# Altium project GN-1866-A-V2_HI3519V101.PRJPCB (part 2 of 4)

## Sheet P09 SYS of Hi3519.SchDoc
size 420 x 297 mm
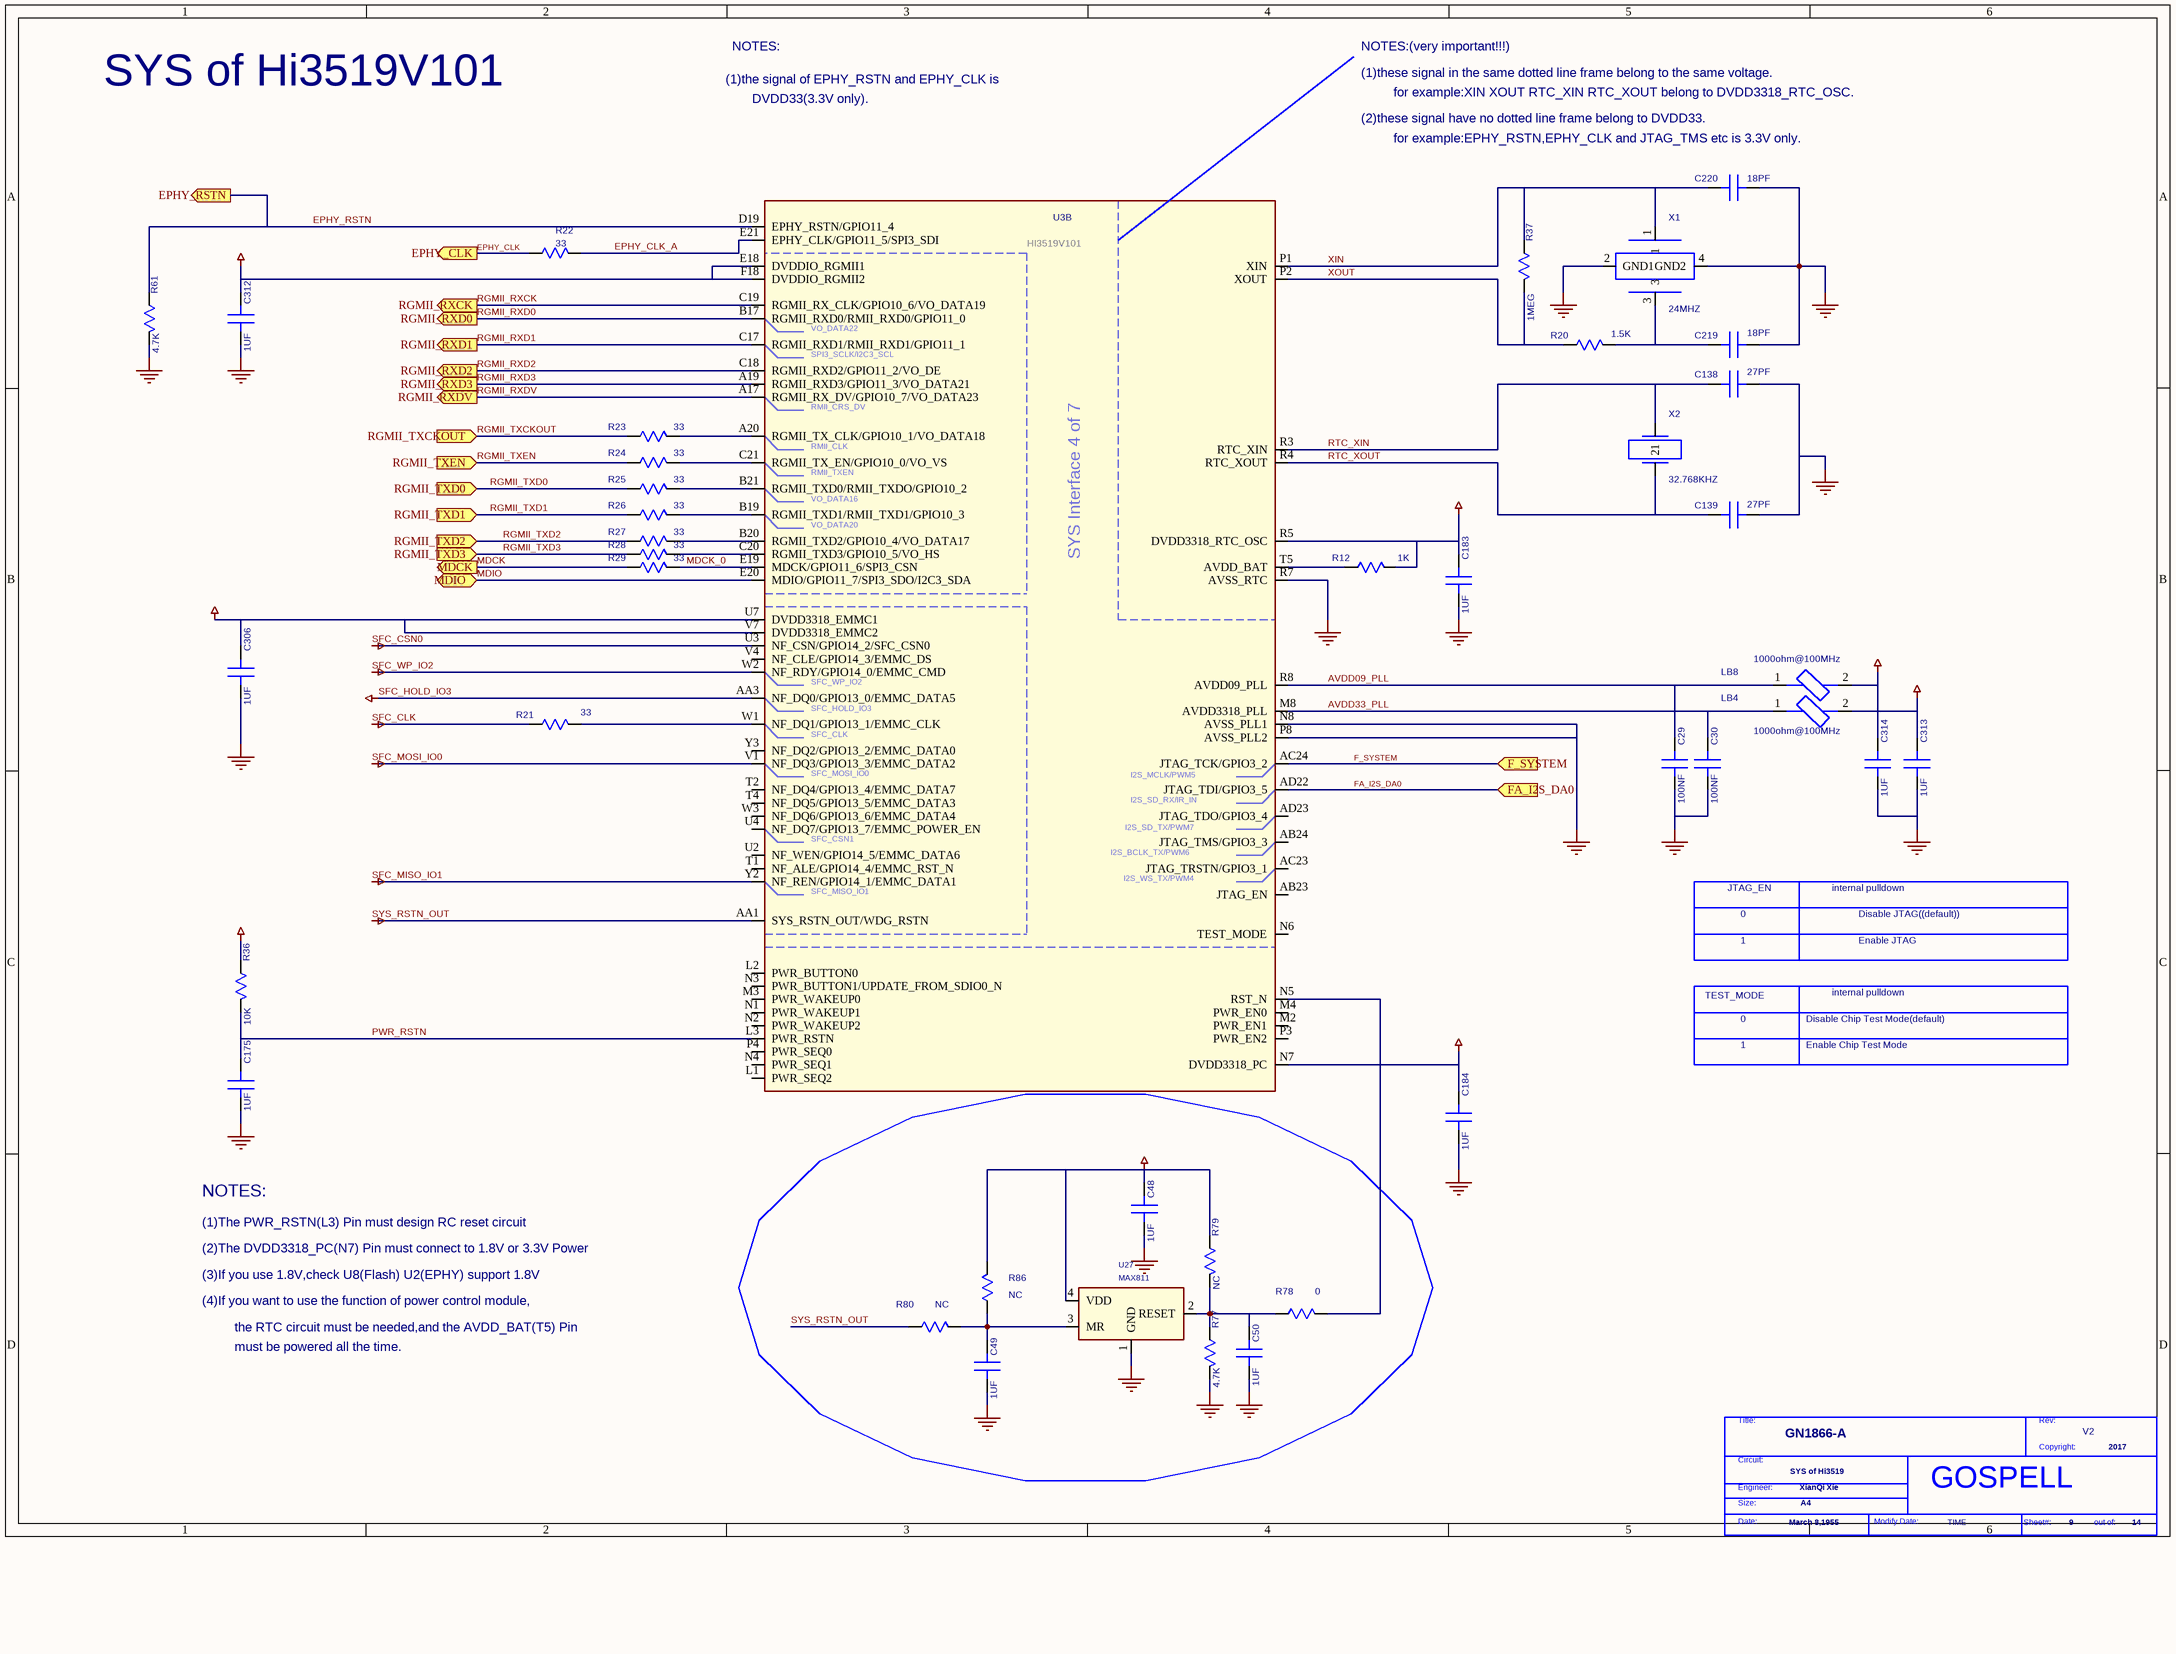
[diagram p5: P09 SYS of Hi3519.SchDoc]

### Parts
(Parts that share a designator on the sheet are numbered #1, #2 ... from top to bottom, then left to right.)
*#6  Page Modify Date: TIME  Engineer: XianQi Xie  Copyright: 2017  Title: GN1866-A  RevCode: V2  Page Size: A4  Page Create Date: March 8,1955  Page Number: 9  Page Count: 14  Doc: SYS of Hi3519  (hidden comment: GOSPELL)  (graphical)
C29  100NF  [HSC0201]
C30  100NF  [HSC0201]
C48  1UF  [SC0402]
C49  1UF  [SC0402]
C50  1UF  [SC0402]
C138  27PF  [SC0402]
C139  27PF  [SC0402]
C175  1UF  [HSC0201]
C183  1UF  [HSC0201]
C184  1UF  [HSC0201]
C219  18PF  [SC0402]
C220  18PF  [SC0402]
C306  1UF  [HSC0201]
C312  1UF  [HSC0201]
C313  1UF  [HSC0201]
C314  1UF  [HSC0201]
LB4  LB  [HSL0201-TB]  (value not drawn)
LB8  LB  [HSL0201-TB]  (value not drawn)
R12  1K  [SR0402]
R20  1.5K  [SR0402]
R21  33  [SR0402]
R22  33  [SR0402]
R23  33  [SR0402]
R24  33  [SR0402]
R25  33  [SR0402]
R26  33  [SR0402]
R27  33  [SR0402]
R28  33  [SR0402]
R29  33  [SR0402]
R36  10K  [SR0402]
R37  1MEG  [SR0402]
R61  4.7K  [SR0402]
R77  4.7K  [SR0402]
R78  0  [SR0402]
R79  NC  [SR0402]
R80  NC  [SR0402]
R86  NC  [SR0402]
U3  DEVICE: HI3519V101  [HBGA524-16-2424]  (hidden comment: HI3519V101_PER)  (part B of 7)
U27  MAX811  [SOT23-4]
X1  24MHZ  [HSX4-0302]
X2  32.768KHZ  [HSX2-0302]

### Ports
EPHY_CLK (out), EPHY_RSTN (out), F_SYSTEM (in), FA_I2S_DA0 (in), MDCK (out), MDIO (bidir), RGMII_RXCK (out), RGMII_RXD0 (out), RGMII_RXD1 (out), RGMII_RXD2 (out), RGMII_RXD3 (out), RGMII_RXDV (out), RGMII_TXCKOUT (in), RGMII_TXD0 (in), RGMII_TXD1 (in), RGMII_TXD2 (in), RGMII_TXD3 (in), RGMII_TXEN (in)

### Nets
3V3/1V8: C48.1(A) C183.1(A) C184.1(A) C306.1(A) C312.1(A) C313.1(A) LB4.2 R12.2(B) R36.1(A) R79.1(A) R86.2(B) U3.E18(DVDDIO_RGMII1) U3.F18(DVDDIO_RGMII2) U3.N7(DVDD3318_PC) U3.R5(DVDD3318_RTC_OSC) U3.U7(DVDD3318_EMMC1) U3.V7(DVDD3318_EMMC2) U27.4(VDD)
GND: C29.2(B) C30.2(B) C48.2(B) C49.2(B) C50.2(B) C138.2(B) C139.2(B) C175.2(B) C183.2(B) C184.2(B) C219.2(B) C220.2(B) C306.2(B) C312.2(B) C313.2(B) C314.2(B) R61.2(B) R77.2(B) U3.N8(AVSS_PLL1) U3.P8(AVSS_PLL2) U3.R7(AVSS_RTC) U27.1(GND) X1.2(GND1) X1.4(GND2)
SFC_CLK: R21.1(A)
SFC_CSN0: U3.U3(NF_CSN/GPIO14_2/SFC_CSN0)
SFC_HOLD_IO3: U3.AA3(NF_DQ0/GPIO13_0/EMMC_DATA5)
SFC_MISO_IO1: U3.Y2(NF_REN/GPIO14_1/EMMC_DATA1)
SFC_MOSI_IO0: U3.V1(NF_DQ3/GPIO13_3/EMMC_DATA2)
SFC_WP_IO2: U3.W2(NF_RDY/GPIO14_0/EMMC_CMD)
SYS_RSTN_OUT: R80.1(A) U3.AA1(SYS_RSTN_OUT/WDG_RSTN)
VCC_VDD_DDR_CORE: C314.1(A) LB8.2
AVDD09_PLL: C29.1(A) LB8.1 U3.R8(AVDD09_PLL)
AVDD33_PLL: C30.1(A) LB4.1 U3.M8(AVDD3318_PLL)
EPHY_CLK: R22.1(A) ; port EPHY_CLK
EPHY_CLK_A: R22.2(B) U3.E21(EPHY_CLK/GPIO11_5/SPI3_SDI)
EPHY_RSTN: R61.1(A) U3.D19(EPHY_RSTN/GPIO11_4) ; port EPHY_RSTN
F_SYSTEM: U3.AC24(JTAG_TCK/GPIO3_2) ; port F_SYSTEM
FA_I2S_DA0: U3.AD22(JTAG_TDI/GPIO3_5) ; port FA_I2S_DA0
MDCK: R29.1(A) ; port MDCK
MDCK_0: R29.2(B) U3.E19(MDCK/GPIO11_6/SPI3_CSN)
MDIO: U3.E20(MDIO/GPIO11_7/SPI3_SDO/I2C3_SDA) ; port MDIO
PWR_RSTN: C175.1(A) R36.2(B) U3.L3(PWR_RSTN)
RGMII_RXCK: U3.C19(RGMII_RX_CLK/GPIO10_6/VO_DATA19) ; port RGMII_RXCK
RGMII_RXD0: U3.B17(RGMII_RXD0/RMII_RXD0/GPIO11_0) ; port RGMII_RXD0
RGMII_RXD1: U3.C17(RGMII_RXD1/RMII_RXD1/GPIO11_1) ; port RGMII_RXD1
RGMII_RXD2: U3.C18(RGMII_RXD2/GPIO11_2/VO_DE) ; port RGMII_RXD2
RGMII_RXD3: U3.A19(RGMII_RXD3/GPIO11_3/VO_DATA21) ; port RGMII_RXD3
RGMII_RXDV: U3.A17(RGMII_RX_DV/GPIO10_7/VO_DATA23) ; port RGMII_RXDV
RGMII_TXCKOUT: R23.1(A) ; port RGMII_TXCKOUT
RGMII_TXD0: R25.1(A) ; port RGMII_TXD0
RGMII_TXD1: R26.1(A) ; port RGMII_TXD1
RGMII_TXD2: R27.1(A) ; port RGMII_TXD2
RGMII_TXD3: R28.1(A) ; port RGMII_TXD3
RGMII_TXEN: R24.1(A) ; port RGMII_TXEN
RTC_XIN: C138.1(A) U3.R3(RTC_XIN) X2.1
RTC_XOUT: C139.1(A) U3.R4(RTC_XOUT) X2.2
XIN: C220.1(A) R37.1(A) U3.P1(XIN) X1.1
XOUT: R20.1(A) R37.2(B) U3.P2(XOUT)
NetC49_1: C49.1(A) R80.2(B) R86.1(A) U27.3(MR)
NetC50_1: C50.1(A) R77.1(A) R78.1(A) R79.2(B) U27.2(RESET)
NetC219_1: C219.1(A) R20.2(B) X1.3
NetR12_1: R12.1(A) U3.T5(AVDD_BAT)
NetR21_2: R21.2(B) U3.W1(NF_DQ1/GPIO13_1/EMMC_CLK)
NetR23_2: R23.2(B) U3.A20(RGMII_TX_CLK/GPIO10_1/VO_DATA18)
NetR24_2: R24.2(B) U3.C21(RGMII_TX_EN/GPIO10_0/VO_VS)
NetR25_2: R25.2(B) U3.B21(RGMII_TXD0/RMII_TXDO/GPIO10_2)
NetR26_2: R26.2(B) U3.B19(RGMII_TXD1/RMII_TXD1/GPIO10_3)
NetR27_2: R27.2(B) U3.B20(RGMII_TXD2/GPIO10_4/VO_DATA17)
NetR28_2: R28.2(B) U3.C20(RGMII_TXD3/GPIO10_5/VO_HS)
NetR78_2: R78.2(B) U3.N5(RST_N)

Not connected (* = marked no-connect by the designer): U3 AB23(JTAG_EN) AB24(JTAG_TMS/GPIO3_3) AC23(JTAG_TRSTN/GPIO3_1) AD23(JTAG_TDO/GPIO3_4) L1(PWR_SEQ2) L2(PWR_BUTTON0) M2(PWR_EN1) M3(PWR_WAKEUP0) M4(PWR_EN0) N1(PWR_WAKEUP1) N2(PWR_WAKEUP2) N3(PWR_BUTTON1/UPDATE_FROM_SDIO0_N) N4(PWR_SEQ1) N6(TEST_MODE) P3(PWR_EN2) P4(PWR_SEQ0) T1(NF_ALE/GPIO14_4/EMMC_RST_N) T2(NF_DQ4/GPIO13_4/EMMC_DATA7) T4(NF_DQ5/GPIO13_5/EMMC_DATA3) U2(NF_WEN/GPIO14_5/EMMC_DATA6) U4(NF_DQ7/GPIO13_7/EMMC_POWER_EN) V4(NF_CLE/GPIO14_3/EMMC_DS) W3(NF_DQ6/GPIO13_6/EMMC_DATA4) Y3(NF_DQ2/GPIO13_2/EMMC_DATA0)

### Notes on the sheet
- NOTES:
- NOTES:(very important!!!)
- SYS of Hi3519V101
- (1)the signal of EPHY_RSTN and EPHY_CLK is
- DVDD33(3.3V only).
- (2)these signal have no dotted line frame belong to DVDD33.
- (1)these signal in the same dotted line frame belong to the same voltage.
- for example:XIN XOUT RTC_XIN RTC_XOUT belong to DVDD3318_RTC_OSC.
- (near C220) for example:EPHY_RSTN,EPHY_CLK and JTAG_TMS etc is 3.3V only.
- (near LB8) 1000ohm@100MHz
- (near LB4) 1000ohm@100MHz
- JTAG_EN
- internal pulldown
- 1
- 0
- Disable JTAG((default))
- Enable JTAG
- TEST_MODE
- Disable Chip Test Mode(default)
- Enable Chip Test Mode
- (1)The PWR_RSTN(L3) Pin must design RC reset circuit
- (3)If you use 1.8V,check U8(Flash) U2(EPHY) support 1.8V
- (2)The DVDD3318_PC(N7) Pin must connect to 1.8V or 3.3V Power
- (4)If you want to use the function of power control module,
- the RTC circuit must be needed,and the AVDD_BAT(T5) Pin
- must be powered all the time.
- (in symbol GOSPELL) Title:; Rev:; Copyright:; Circuit:; Engineer:; Size:; Date:; Modify Date:; Sheet#:; out of:
- (in symbol HI3519V101_PER_2, part B) VO_DATA22; SPI3_SCLK/I2C3_SCL; RMII_CRS_DV; RMII_CLK; RMII_TXEN; VO_DATA16; VO_DATA20; SYS Interface 4 of 7; SFC_WP_IO2; SFC_HOLD_IO3; SFC_CLK; SFC_MOSI_IO0; I2S_MCLK/PWM5; I2S_SD_RX/IR_IN; I2S_SD_TX/PWM7; SFC_CSN1; I2S_BCLK_TX/PWM6; I2S_WS_TX/PWM4; SFC_MISO_IO1

### Library data of the parts
C29 C30 = C_0_Dup2: PARTS: 1; OriginalSymbolOrigin: (0,30); DEVICE: GRM033R60J104KE19D; LEVEL: STD; PINSWAP: (A,B); CODE: 8070704; %195%%232%%202%%246%: SMD陶瓷电容-6.3V-100NF-+/-10%-X5R-0201-TS16949; %182%%238%%182%%168%%185%%164%%215%%247%%181%%231%%209%%185%(V): 6.3; COMPONENT_HIGH_MAX: 0.33MM; %208%%161%%192%%224%%195%%251%%179%%198%: SMD陶瓷电容; GVALUE: C  6.3V  0.1uF +80%~-20%  X5R 0201; PKG_TYPE: HSC0201
C48-C50 = C_0_Dup2: PARTS: 1; OriginalSymbolOrigin: (0,30); DEVICE: CV05X5R105K10AH; LEVEL: STD; PINSWAP: (A,B); GVALUE: C  10V  1uF +80%~-20%  X5R 0402; CODE: 8070612; %195%%232%%202%%246%: SMD陶瓷电容-10V-1000NF-+/-10%-X5R-0402-BT,TS16949; %182%%238%%182%%168%%185%%164%%215%%247%%181%%231%%209%%185%(V): 10; COMPONENT_HIGH_MAX: 0.55MM; %208%%161%%192%%224%%195%%251%%179%%198%: SMD陶瓷电容; PKG_TYPE: SC0402
C138 = C_0_Dup2: PARTS: 1; OriginalSymbolOrigin: (0,30); DEVICE: C0402C270J5GAC_7867; LEVEL: STD; PINSWAP: (A,B); %208%%161%%192%%224%%195%%251%%179%%198%: SMD陶瓷电容; COMPONENT_HIGH_MAX: 0.55MM; %182%%238%%182%%168%%185%%164%%215%%247%%181%%231%%209%%185%(V): 50; %195%%232%%202%%246%: SMD陶瓷电容-50V-0.027NF-+/-5%-NP0-0402-BT; CODE: 8070546; GVALUE: C  50V  27pF +80%~-20% NP0 0402; PKG_TYPE: SC0402
C139 = C_0_Dup2: PARTS: 1; OriginalSymbolOrigin: (0,30); DEVICE: C0402C270J5GAC_7867; LEVEL: STD; PINSWAP: (A,B); CODE: 8070546; %195%%232%%202%%246%: SMD陶瓷电容-50V-0.027NF-+/-5%-NP0-0402-BT; %182%%238%%182%%168%%185%%164%%215%%247%%181%%231%%209%%185%(V): 50; COMPONENT_HIGH_MAX: 0.55MM; %208%%161%%192%%224%%195%%251%%179%%198%: SMD陶瓷电容; GVALUE: C  50V  27pF +80%~-20% NP0 0402; PKG_TYPE: SC0402
C175 = C_0_Dup2: PARTS: 1; OriginalSymbolOrigin: (0,30); DEVICE: CM03X5R105M06AH_A; LEVEL: STD; PINSWAP: (A,B); %208%%161%%192%%224%%195%%251%%179%%198%: SMD陶瓷电容; COMPONENT_HIGH_MAX: 0.35MM; %195%%232%%202%%246%: SMD陶瓷电容-4V-1000NF-+/-20%-X5R-0201(0.65MM*0.35MM*0.35MM)-终端专用; CODE: 8071128; GVALUE: C  4V  1uF +80%~-20%  X5R 0201(0.65MM*0.35MM*0.35MM); PKG_TYPE: HSC0201
C183 C312 C314 = C_0_Dup2: PARTS: 1; OriginalSymbolOrigin: (0,30); DEVICE: CM03X5R105M06AH_A; LEVEL: STD; PINSWAP: (A,B); %208%%161%%192%%224%%195%%251%%179%%198%: SMD陶瓷电容; COMPONENT_HIGH_MAX: 0.35MM; %182%%238%%182%%168%%185%%164%%215%%247%%181%%231%%209%%185%(V): 6.3; %195%%232%%202%%246%: SMD陶瓷电容-4V-1000NF-+/-20%-X5R-0201(0.65MM*0.35MM*0.35MM)-终端专用; CODE: 8071128; GVALUE: C  4V  1uF +80%~-20%  X5R 0201(0.65MM*0.35MM*0.35MM); PKG_TYPE: HSC0201
C184 C313 = C_0_Dup2: PARTS: 1; OriginalSymbolOrigin: (0,30); DEVICE: CM03X5R105M06AH_A; LEVEL: STD; PINSWAP: (A,B); CODE: 8071128; %195%%232%%202%%246%: SMD陶瓷电容-4V-1000NF-+/-20%-X5R-0201(0.65MM*0.35MM*0.35MM)-终端专用; %182%%238%%182%%168%%185%%164%%215%%247%%181%%231%%209%%185%(V): 6.3; COMPONENT_HIGH_MAX: 0.35MM; %208%%161%%192%%224%%195%%251%%179%%198%: SMD陶瓷电容; GVALUE: C  4V  1uF +80%~-20%  X5R 0201(0.65MM*0.35MM*0.35MM); PKG_TYPE: HSC0201
C219 = C_0_Dup2: PARTS: 1; OriginalSymbolOrigin: (0,30); DEVICE: C0402C180J5GAC_7867; LEVEL: STD; PINSWAP: (A,B); CODE: 8070580; %195%%232%%202%%246%: SMD陶瓷电容-50V-0.018NF-+/-5%-NPO-0402; %182%%238%%182%%168%%185%%164%%215%%247%%181%%231%%209%%185%(V): 50; COMPONENT_HIGH_MAX: 0.55MM; %208%%161%%192%%224%%195%%251%%179%%198%: SMD陶瓷电容; GVALUE: C  50V  18pF +80%~-20% NPO-0402; PKG_TYPE: SC0402
C220 = C_0_Dup2: PARTS: 1; OriginalSymbolOrigin: (0,30); DEVICE: C0402C180J5GAC_7867; LEVEL: STD; PINSWAP: (A,B); GVALUE: C  50V  18pF +80%~-20% NPO-0402; CODE: 8070580; %195%%232%%202%%246%: SMD陶瓷电容-50V-0.018NF-+/-5%-NPO-0402; %182%%238%%182%%168%%185%%164%%215%%247%%181%%231%%209%%185%(V): 50; COMPONENT_HIGH_MAX: 0.55MM; %208%%161%%192%%224%%195%%251%%179%%198%: SMD陶瓷电容; PKG_TYPE: SC0402
C306 = C_0_Dup2: PARTS: 1; OriginalSymbolOrigin: (0,30); DEVICE: CM03X5R105M06AH_A; LEVEL: STD; PINSWAP: (A,B); %208%%161%%192%%224%%195%%251%%179%%198%: SMD陶瓷电容; COMPONENT_HIGH_MAX: 0.35MM; %182%%238%%182%%168%%185%%164%%215%%247%%181%%231%%209%%185%(V): 10; %195%%232%%202%%246%: SMD陶瓷电容-4V-1000NF-+/-20%-X5R-0201(0.65MM*0.35MM*0.35MM)-终端专用; CODE: 8071128; GVALUE: C  4V  1uF +80%~-20%  X5R 0201(0.65MM*0.35MM*0.35MM); PKG_TYPE: HSC0201
LB4 = LB_0: PARTS: 1; OriginalSymbolOrigin: (20,50); LEVEL: STD; DEVICE: NOOO; CODE: 99053XWH; %195%%232%%202%%246%: EMI磁珠-+/-25%-1000OHM-1.25OHM-0.25A-0402-1400OHM@1GHZ; COMPONENT_HIGH_MAX: 0.65MM; %208%%161%%192%%224%%195%%251%%179%%198%: EMI磁珠; GVALUE: 麦捷:0201磁珠80欧; PKG_TYPE: HSL0201-TB
LB8 = LB_0: PARTS: 1; OriginalSymbolOrigin: (20,50); LEVEL: STD; DEVICE: NOOO; CODE: 99053XWH; %208%%161%%192%%224%%195%%251%%179%%198%: EMI磁珠; COMPONENT_HIGH_MAX: 0.65MM; %195%%232%%202%%246%: EMI磁珠-+/-25%-1000OHM-1.25OHM-0.25A-0402-1400OHM@1GHZ; GVALUE: 麦捷:0201磁珠80欧; PKG_TYPE: HSL0201-TB
R12 = R_0: PARTS: 1; OriginalSymbolOrigin: (10,20); PINSWAP: (A,B); DEVICE: RC0603JR_07510R; PKG_TYPE: SR0603; LEVEL: STD; CODE: 7090638; %195%%232%%202%%246%: 片式厚膜电阻器-0.1W-510OHM-+/-5%-0603; %182%%238%%182%%168%%185%%166%%194%%202%(W): 0.1; %215%%232%%214%%181%%212%%202%%208%%237%%198%%171%%178%%238%: +/-5%; COMPONENT_HIGH_MAX: 0.55MM; %208%%161%%192%%224%%195%%251%%179%%198%: 片式厚膜电阻器; GVALUE: R 1/16W 1K±5% 0402
R20 = R_0: PARTS: 1; OriginalSymbolOrigin: (10,20); PINSWAP: (A,B); DEVICE: RC_02W100FT; LEVEL: STD; CODE: 7091305; %195%%232%%202%%246%: 片式厚膜电阻器-0.0625W-10OHM-+/-1%-0402; %182%%238%%182%%168%%185%%166%%194%%202%(W): 0.06; %215%%232%%214%%181%%212%%202%%208%%237%%198%%171%%178%%238%: +/-1%; COMPONENT_HIGH_MAX: 0.4MM; %208%%161%%192%%224%%195%%251%%179%%198%: 片式厚膜电阻器; GVALUE: R 1/16W 1.5K±5% 0402; PKG_TYPE: SR0402
R21 R23-R29 = R_0: PARTS: 1; OriginalSymbolOrigin: (10,20); PINSWAP: (A,B); DEVICE: RC0402FR_0733RL; LEVEL: STD; CODE: 7090836; %195%%232%%202%%246%: 片式厚膜电阻器-0.0625W-33OHM-+/-1%-0402; %182%%238%%182%%168%%185%%166%%194%%202%(W): 0.06; %215%%232%%214%%181%%212%%202%%208%%237%%198%%171%%178%%238%: +/-1%; COMPONENT_HIGH_MAX: 0.4MM; %208%%161%%192%%224%%195%%251%%179%%198%: 片式厚膜电阻器; GVALUE: R 1/16W 33±5% 0402; PKG_TYPE: SR0402
R22 = R_0: PARTS: 1; OriginalSymbolOrigin: (10,20); PINSWAP: (A,B); DEVICE: RC0402FR_0733RL; LEVEL: STD; %208%%161%%192%%224%%195%%251%%179%%198%: 片式厚膜电阻器; COMPONENT_HIGH_MAX: 0.4MM; %215%%232%%214%%181%%212%%202%%208%%237%%198%%171%%178%%238%: +/-1%; %182%%238%%182%%168%%185%%166%%194%%202%(W): 0.06; %195%%232%%202%%246%: 片式厚膜电阻器-0.0625W-33OHM-+/-1%-0402; CODE: 7090836; GVALUE: R 1/16W 33±5% 0402; PKG_TYPE: SR0402
R36 = R_0: PARTS: 1; OriginalSymbolOrigin: (10,20); PINSWAP: (A,B); DEVICE: RC_02W103JT; LEVEL: STD; CODE: 7090815; %195%%232%%202%%246%: 片式厚膜电阻器-0.0625W-10000OHM-+/-5%-0402-BT; %182%%238%%182%%168%%185%%166%%194%%202%(W): 0.06; %215%%232%%214%%181%%212%%202%%208%%237%%198%%171%%178%%238%: +/-5%; COMPONENT_HIGH_MAX: 0.4MM; %208%%161%%192%%224%%195%%251%%179%%198%: 片式厚膜电阻器; GVALUE: R 1/16W 10K±5% 0402; PKG_TYPE: SR0402
R37 = R_0: PARTS: 1; OriginalSymbolOrigin: (10,20); PINSWAP: (A,B); DEVICE: RK73H1ETTP1004F; LEVEL: STD; GVALUE: R 1/16W 1M±5% 0402; CODE: 7090857; %195%%232%%202%%246%: 片式厚膜电阻器-0.0625W-1000000OHM-+/-1%-0402; %182%%238%%182%%168%%185%%166%%194%%202%(W): 0.06; %215%%232%%214%%181%%212%%202%%208%%237%%198%%171%%178%%238%: +/-1%; COMPONENT_HIGH_MAX: 0.4MM; %208%%161%%192%%224%%195%%251%%179%%198%: 片式厚膜电阻器; PKG_TYPE: SR0402
R61 = R_0: PARTS: 1; OriginalSymbolOrigin: (10,20); PINSWAP: (A,B); DEVICE: RK73B1ELTP472J; LEVEL: STD; CODE: 7090793; %195%%232%%202%%246%: 片式厚膜电阻器-0.0625W-4700OHM-+/-5%-0402-BT; %182%%238%%182%%168%%185%%166%%194%%202%(W): 0.06; %215%%232%%214%%181%%212%%202%%208%%237%%198%%171%%178%%238%: +/-5%; COMPONENT_HIGH_MAX: 0.4MM; %208%%161%%192%%224%%195%%251%%179%%198%: 片式厚膜电阻器; GVALUE: R 1/16W 4.7K±5% 0402; PKG_TYPE: SR0402
R77 = R_0: PARTS: 1; OriginalSymbolOrigin: (10,20); PINSWAP: (A,B); DEVICE: RK73B1ELTP472J; LEVEL: STD; %208%%161%%192%%224%%195%%251%%179%%198%: 片式厚膜电阻器; COMPONENT_HIGH_MAX: 0.4MM; %215%%232%%214%%181%%212%%202%%208%%237%%198%%171%%178%%238%: +/-5%; %182%%238%%182%%168%%185%%166%%194%%202%(W): 0.06; %195%%232%%202%%246%: 片式厚膜电阻器-0.0625W-4700OHM-+/-5%-0402-BT; CODE: 7090793; GVALUE: R 1/16W 4.7K±5% 0402; PKG_TYPE: SR0402
R78 = R_0: PARTS: 1; OriginalSymbolOrigin: (10,20); PINSWAP: (A,B); DEVICE: RK73B1ELTP472J; LEVEL: STD; %208%%161%%192%%224%%195%%251%%179%%198%: 片式厚膜电阻器; COMPONENT_HIGH_MAX: 0.4MM; %215%%232%%214%%181%%212%%202%%208%%237%%198%%171%%178%%238%: +/-5%; %182%%238%%182%%168%%185%%166%%194%%202%(W): 0.06; %195%%232%%202%%246%: 片式厚膜电阻器-0.0625W-4700OHM-+/-5%-0402-BT; CODE: 7090793; GVALUE: R 1/16W 0±5% 0402; PKG_TYPE: SR0402
R79 R80 = R_0: PARTS: 1; OriginalSymbolOrigin: (10,20); PINSWAP: (A,B); DEVICE: RK73B1ELTP472J; LEVEL: STD; CODE: 7090793; %195%%232%%202%%246%: 片式厚膜电阻器-0.0625W-4700OHM-+/-5%-0402-BT; %182%%238%%182%%168%%185%%166%%194%%202%(W): 0.06; %215%%232%%214%%181%%212%%202%%208%%237%%198%%171%%178%%238%: +/-5%; COMPONENT_HIGH_MAX: 0.4MM; %208%%161%%192%%224%%195%%251%%179%%198%: 片式厚膜电阻器; PKG_TYPE: SR0402; GVALUE: NC
R86 = R_0: PARTS: 1; OriginalSymbolOrigin: (10,20); PINSWAP: (A,B); DEVICE: RK73B1ELTP472J; LEVEL: STD; %208%%161%%192%%224%%195%%251%%179%%198%: 片式厚膜电阻器; COMPONENT_HIGH_MAX: 0.4MM; %215%%232%%214%%181%%212%%202%%208%%237%%198%%171%%178%%238%: +/-5%; %182%%238%%182%%168%%185%%166%%194%%202%(W): 0.06; %195%%232%%202%%246%: 片式厚膜电阻器-0.0625W-4700OHM-+/-5%-0402-BT; CODE: 7090793; PKG_TYPE: SR0402; GVALUE: NC
U3 = HI3519V101_PER_2: PARTS: 1; OriginalSymbolOrigin: (0,840); LEVEL: STD; HETERO: (HI3519V101_PWR),(HI3519V101_DDR),(HI3519V101_SYS),(HI3519V101_VIVO),(HI3519V101_PER),(HI3519V101_VSS1),(HI3519V101_VSS2); CODE: G01428016_MODZH; %195%%232%%202%%246%: 请注意是HDI板，建库的时候请注意下-02323838; COMPONENT_HIGH_MAX: 0.98MM; CaptureCellPackProp: HI3519V101_PERB; FORWARD_PCB: 1; PKG_TYPE: HBGA524-16-2424; GVALUE: HI3519V101_PER
X1 = X_B_0: PARTS: 1; OriginalSymbolOrigin: (20,80); LEVEL: STD; DEVICE: NX3225SA24MHZ; CODE: 12020151; %195%%232%%202%%246%: 晶体谐振器-24MHZ-12PF-±30PPM-50OHM-HCX-3SB-终端专用-终端专用; COMPONENT_HIGH_MAX: 0.75MM; %208%%161%%192%%224%%195%%251%%179%%198%: 晶体谐振器; GVALUE: 无源晶体 NX3225SA-24MHZ 30PPM 20PF; PKG_TYPE: HSX4-0302
X2 = X_0: PARTS: 1; OriginalSymbolOrigin: (10,40); LEVEL: STD; DEVICE: 9H03200019; CODE: 12020212; %195%%232%%202%%246%: 晶体谐振器-0.032768MHZ-12.5PF-+/-20PPM-70000OHM-SMD3.2*1.5; COMPONENT_HIGH_MAX: 0.85MM; %208%%161%%192%%224%%195%%251%%179%%198%: 晶体谐振器; GVALUE: 无源晶体 NX3225SA-24MHZ 30PPM 20PF; PKG_TYPE: HSX2-0302
*#6 = GOSPELL: Cage Code: 2017
U27 = MAX811: GVALUE: MAX811

## Sheet P08 DDR3.SchDoc
size 420 x 297 mm
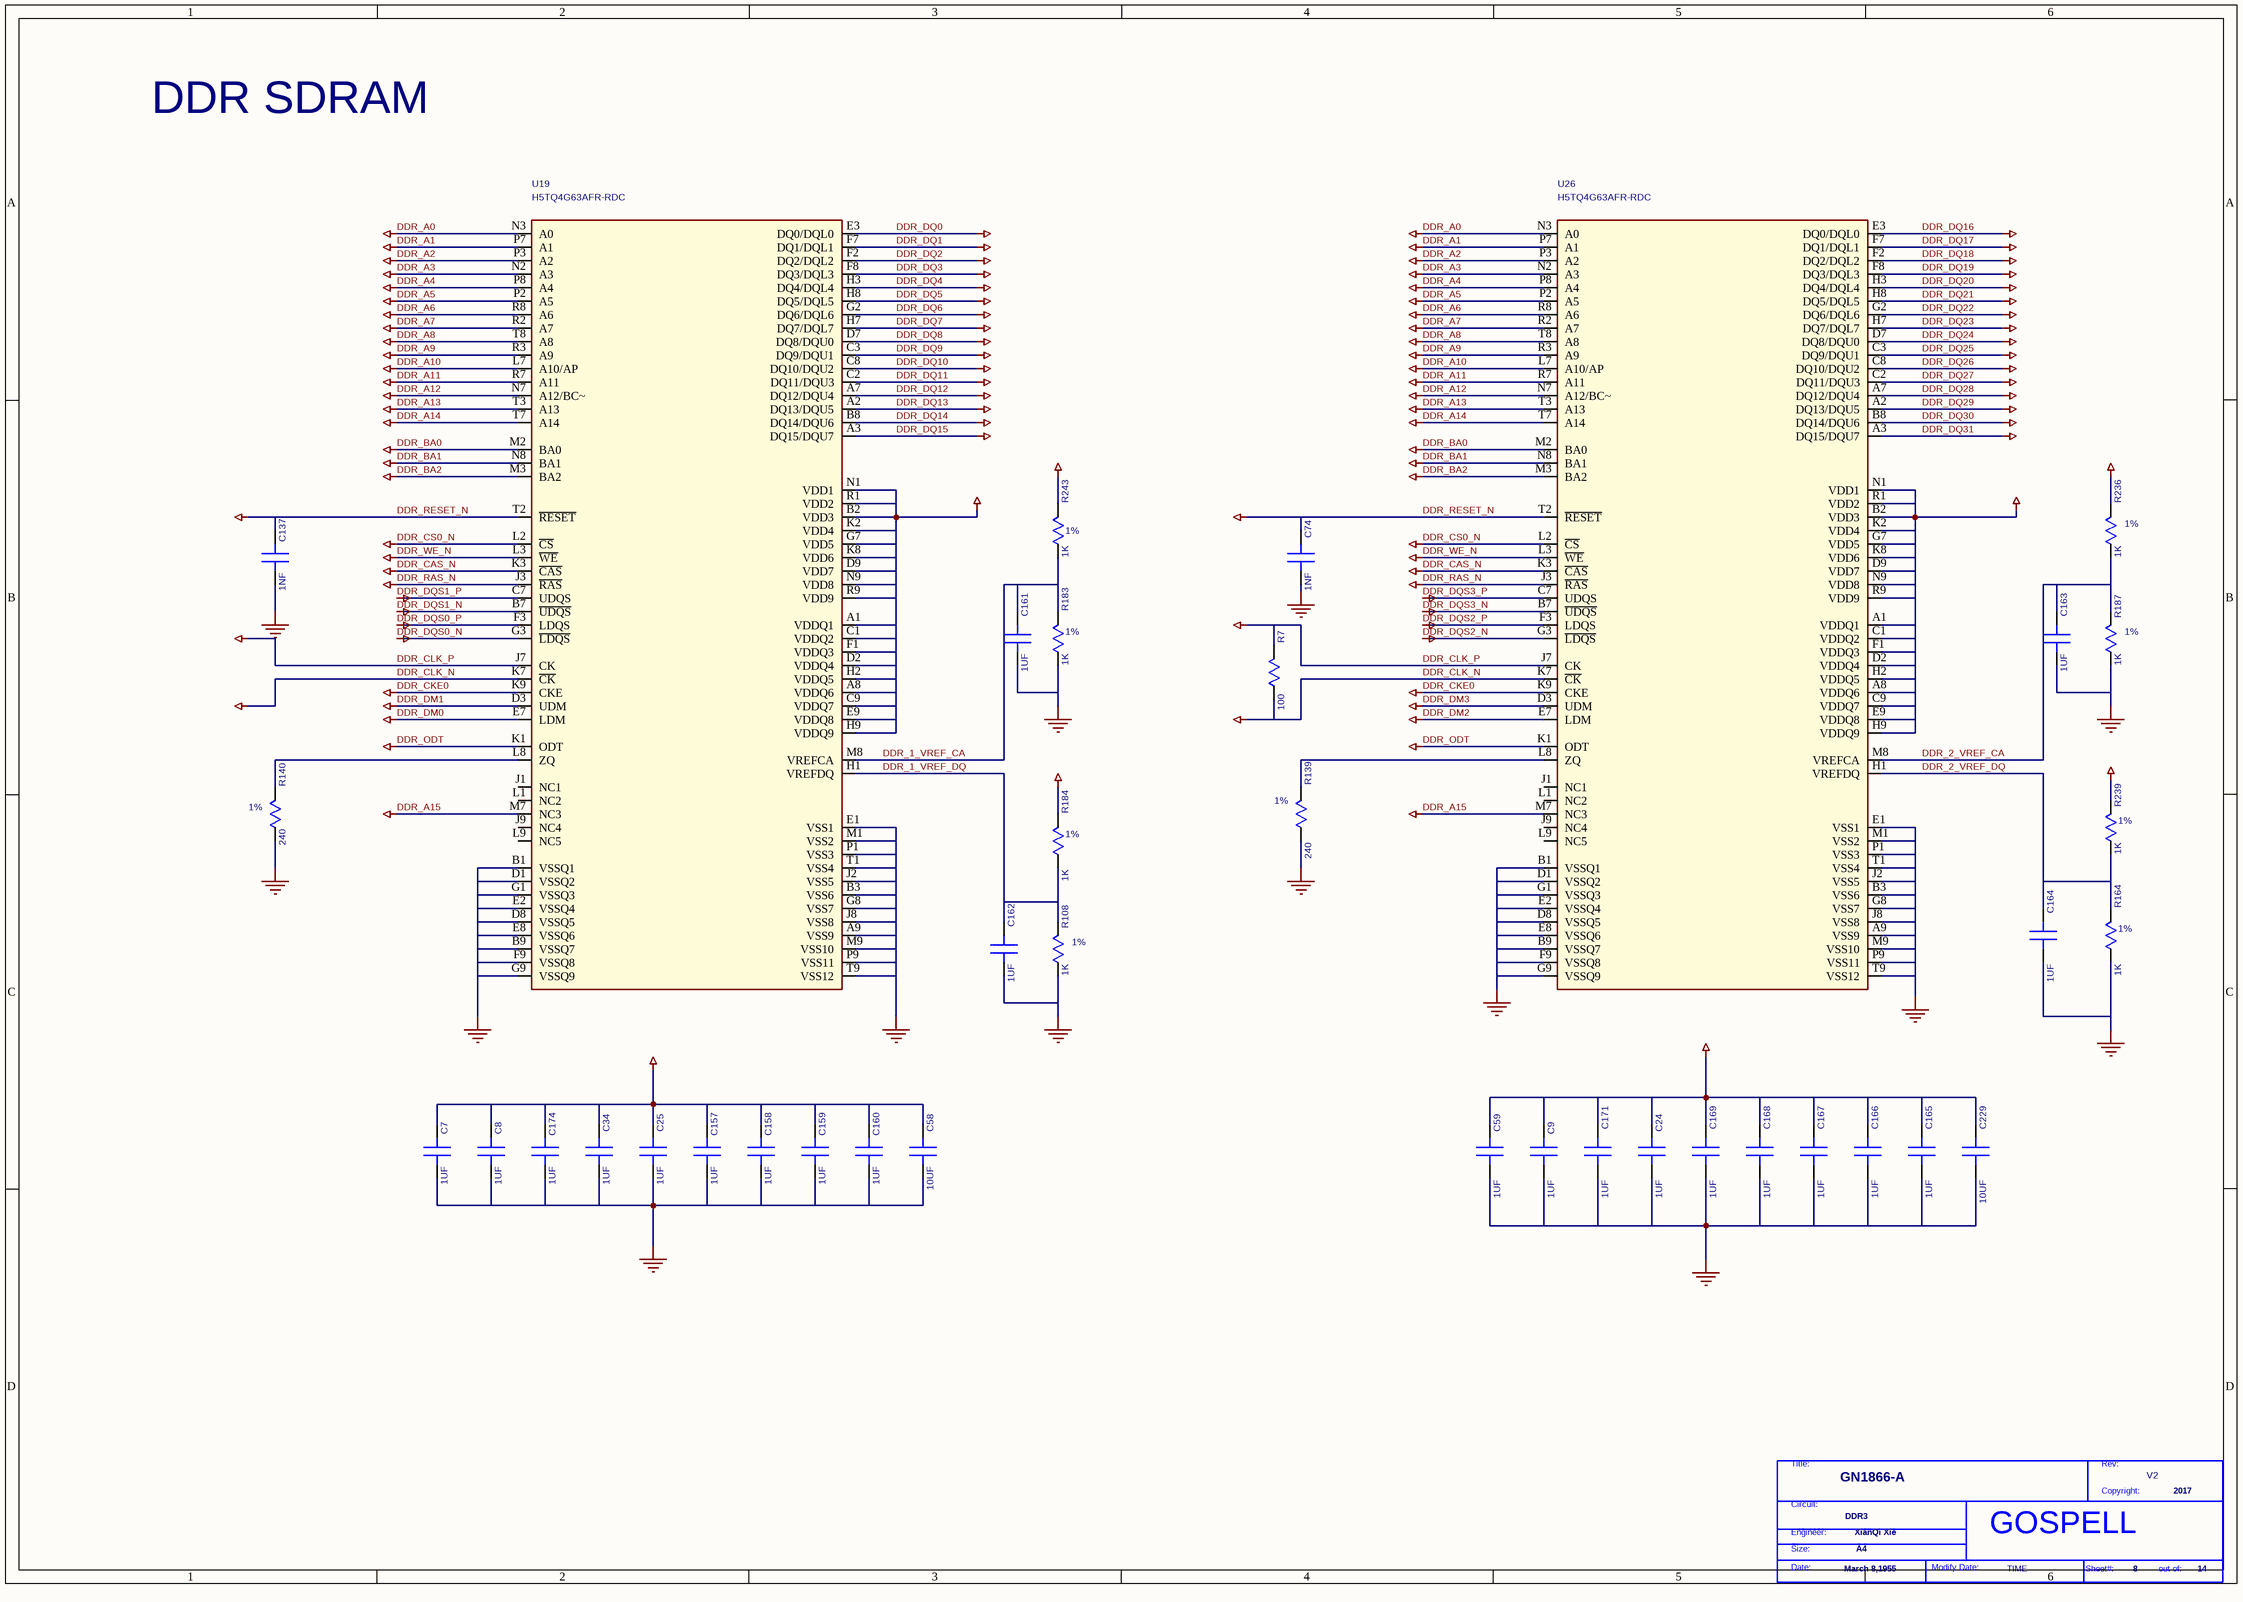
[diagram p6: P08 DDR3.SchDoc]

### Parts
(Parts that share a designator on the sheet are numbered #1, #2 ... from top to bottom, then left to right.)
*#7  Page Modify Date: TIME  Engineer: XianQi Xie  Copyright: 2017  Title: GN1866-A  RevCode: V2  Page Size: A4  Page Create Date: March 8,1955  Page Number: 8  Page Count: 14  Doc: DDR3  (hidden comment: GOSPELL)  (graphical)
C7  1UF  [SC0402]
C8  1UF  [SC0402]
C9  1UF  [SC0402]
C24  1UF  [SC0402]
C25  1UF  [SC0402]
C34  1UF  [SC0402]
C58  10UF  [SC0603]
C59  1UF  [SC0402]
C74  1NF  [SC0402]
C137  1NF  [SC0402]
C157  1UF  [SC0402]
C158  1UF  [SC0402]
C159  1UF  [SC0402]
C160  1UF  [SC0402]
C161  1UF  [SC0402]
C162  1UF  [SC0402]
C163  1UF  [SC0402]
C164  1UF  [SC0402]
C165  1UF  [SC0402]
C166  1UF  [SC0402]
C167  1UF  [SC0402]
C168  1UF  [SC0402]
C169  1UF  [SC0402]
C171  1UF  [SC0402]
C174  1UF  [SC0402]
C229  10UF  [SC0603]
R7  100  [SR0402]
R108  1K  [SR0402]
R139  240  [SR0402]
R140  240  [SR0402]
R164  1K  [SR0402]
R183  1K  [SR0402]
R184  1K  [SR0402]
R187  1K  [SR0402]
R236  1K  [SR0402]
R239  1K  [SR0402]
R243  1K  [SR0402]
U19  DEVICE: H5TQ4G63AFR-RDC  [BGA96-32-1609G]  (hidden comment: NT5CC256M16CP)
U26  DEVICE: H5TQ4G63AFR-RDC  [BGA96-32-1609G]  (hidden comment: NT5CC256M16CP)

### Nets
1V35/1V5: C7.1(A) C8.1(A) C9.1(A) C24.1(A) C25.1(A) C34.1(A) C58.1(A) C59.1(A) C157.1(A) C158.1(A) C159.1(A) C160.1(A) C165.1(A) C166.1(A) C167.1(A) C168.1(A) C169.1(A) C171.1(A) C174.1(A) C229.1(A) R184.2(B) R236.2(B) R239.2(B) R243.2(B) U19.A1(VDDQ1) U19.A8(VDDQ6) U19.B2(VDD3) U19.C1(VDDQ2) U19.C9(VDDQ7) U19.D2(VDDQ4) U19.D9(VDD7) U19.E9(VDDQ8) U19.F1(VDDQ3) U19.G7(VDD5) U19.H2(VDDQ5) U19.H9(VDDQ9) U19.K2(VDD4) U19.K8(VDD6) U19.N1(VDD1) U19.N9(VDD8) U19.R1(VDD2) U19.R9(VDD9) U26.A1(VDDQ1) U26.A8(VDDQ6) U26.B2(VDD3) U26.C1(VDDQ2) U26.C9(VDDQ7) U26.D2(VDDQ4) U26.D9(VDD7) U26.E9(VDDQ8) U26.F1(VDDQ3) U26.G7(VDD5) U26.H2(VDDQ5) U26.H9(VDDQ9) U26.K2(VDD4) U26.K8(VDD6) U26.N1(VDD1) U26.N9(VDD8) U26.R1(VDD2) U26.R9(VDD9)
DDR_A0: U19.N3(A0) U26.N3(A0)
DDR_A1: U19.P7(A1) U26.P7(A1)
DDR_A2: U19.P3(A2) U26.P3(A2)
DDR_A3: U19.N2(A3) U26.N2(A3)
DDR_A4: U19.P8(A4) U26.P8(A4)
DDR_A5: U19.P2(A5) U26.P2(A5)
DDR_A6: U19.R8(A6) U26.R8(A6)
DDR_A7: U19.R2(A7) U26.R2(A7)
DDR_A8: U19.T8(A8) U26.T8(A8)
DDR_A9: U19.R3(A9) U26.R3(A9)
DDR_A10: U19.L7(A10/AP) U26.L7(A10/AP)
DDR_A11: U19.R7(A11) U26.R7(A11)
DDR_A12: U19.N7(A12/BC~) U26.N7(A12/BC~)
DDR_A13: U19.T3(A13) U26.T3(A13)
DDR_A14: U19.T7(A14) U26.T7(A14)
DDR_A15: U19.M7(NC3) U26.M7(NC3)
DDR_BA0: U19.M2(BA0) U26.M2(BA0)
DDR_BA1: U19.N8(BA1) U26.N8(BA1)
DDR_BA2: U19.M3(BA2) U26.M3(BA2)
DDR_CAS_N: U19.K3(~{CAS}) U26.K3(~{CAS})
DDR_CKE0: U19.K9(CKE) U26.K9(CKE)
DDR_CLK_N: R7.1(A) U19.K7(~{CK}) U26.K7(~{CK})
DDR_CLK_P: R7.2(B) U19.J7(CK) U26.J7(CK)
DDR_CS0_N: U19.L2(~{CS}) U26.L2(~{CS})
DDR_DM0: U19.E7(LDM)
DDR_DM1: U19.D3(UDM)
DDR_DM2: U26.E7(LDM)
DDR_DM3: U26.D3(UDM)
DDR_DQ0: U19.E3(DQ0/DQL0)
DDR_DQ1: U19.F7(DQ1/DQL1)
DDR_DQ2: U19.F2(DQ2/DQL2)
DDR_DQ3: U19.F8(DQ3/DQL3)
DDR_DQ4: U19.H3(DQ4/DQL4)
DDR_DQ5: U19.H8(DQ5/DQL5)
DDR_DQ6: U19.G2(DQ6/DQL6)
DDR_DQ7: U19.H7(DQ7/DQL7)
DDR_DQ8: U19.D7(DQ8/DQU0)
DDR_DQ9: U19.C3(DQ9/DQU1)
DDR_DQ10: U19.C8(DQ10/DQU2)
DDR_DQ11: U19.C2(DQ11/DQU3)
DDR_DQ12: U19.A7(DQ12/DQU4)
DDR_DQ13: U19.A2(DQ13/DQU5)
DDR_DQ14: U19.B8(DQ14/DQU6)
DDR_DQ15: U19.A3(DQ15/DQU7)
DDR_DQ16: U26.E3(DQ0/DQL0)
DDR_DQ17: U26.F7(DQ1/DQL1)
DDR_DQ18: U26.F2(DQ2/DQL2)
DDR_DQ19: U26.F8(DQ3/DQL3)
DDR_DQ20: U26.H3(DQ4/DQL4)
DDR_DQ21: U26.H8(DQ5/DQL5)
DDR_DQ22: U26.G2(DQ6/DQL6)
DDR_DQ23: U26.H7(DQ7/DQL7)
DDR_DQ24: U26.D7(DQ8/DQU0)
DDR_DQ25: U26.C3(DQ9/DQU1)
DDR_DQ26: U26.C8(DQ10/DQU2)
DDR_DQ27: U26.C2(DQ11/DQU3)
DDR_DQ28: U26.A7(DQ12/DQU4)
DDR_DQ29: U26.A2(DQ13/DQU5)
DDR_DQ30: U26.B8(DQ14/DQU6)
DDR_DQ31: U26.A3(DQ15/DQU7)
DDR_DQS0_N: U19.G3(~{LDQS})
DDR_DQS0_P: U19.F3(LDQS)
DDR_DQS1_N: U19.B7(~{UDQS})
DDR_DQS1_P: U19.C7(UDQS)
DDR_DQS2_N: U26.G3(~{LDQS})
DDR_DQS2_P: U26.F3(LDQS)
DDR_DQS3_N: U26.B7(~{UDQS})
DDR_DQS3_P: U26.C7(UDQS)
DDR_ODT: U19.K1(ODT) U26.K1(ODT)
DDR_RAS_N: U19.J3(~{RAS}) U26.J3(~{RAS})
DDR_RESET_N: C74.1(A) C137.1(A) U19.T2(~{RESET}) U26.T2(~{RESET})
DDR_WE_N: U19.L3(~{WE}) U26.L3(~{WE})
GND: C7.2(B) C8.2(B) C9.2(B) C24.2(B) C25.2(B) C34.2(B) C58.2(B) C59.2(B) C74.2(B) C137.2(B) C157.2(B) C158.2(B) C159.2(B) C160.2(B) C161.2(B) C162.2(B) C163.2(B) C164.2(B) C165.2(B) C166.2(B) C167.2(B) C168.2(B) C169.2(B) C171.2(B) C174.2(B) C229.2(B) R108.1(A) R139.1(A) R140.1(A) R164.1(A) R183.1(A) R187.1(A) U19.A9(VSS9) U19.B1(VSSQ1) U19.B3(VSS6) U19.B9(VSSQ7) U19.D1(VSSQ2) U19.D8(VSSQ5) U19.E1(VSS1) U19.E2(VSSQ4) U19.E8(VSSQ6) U19.F9(VSSQ8) U19.G1(VSSQ3) U19.G8(VSS7) U19.G9(VSSQ9) U19.J2(VSS5) U19.J8(VSS8) U19.M1(VSS2) U19.M9(VSS10) U19.P1(VSS3) U19.P9(VSS11) U19.T1(VSS4) U19.T9(VSS12) U26.A9(VSS9) U26.B1(VSSQ1) U26.B3(VSS6) U26.B9(VSSQ7) U26.D1(VSSQ2) U26.D8(VSSQ5) U26.E1(VSS1) U26.E2(VSSQ4) U26.E8(VSSQ6) U26.F9(VSSQ8) U26.G1(VSSQ3) U26.G8(VSS7) U26.G9(VSSQ9) U26.J2(VSS5) U26.J8(VSS8) U26.M1(VSS2) U26.M9(VSS10) U26.P1(VSS3) U26.P9(VSS11) U26.T1(VSS4) U26.T9(VSS12)
DDR_1_VREF_CA: C161.1(A) R183.2(B) R243.1(A) U19.M8(VREFCA)
DDR_1_VREF_DQ: C162.1(A) R108.2(B) R184.1(A) U19.H1(VREFDQ)
DDR_2_VREF_CA: C163.1(A) R187.2(B) R236.1(A) U26.M8(VREFCA)
DDR_2_VREF_DQ: C164.1(A) R164.2(B) R239.1(A) U26.H1(VREFDQ)
NetR139_2: R139.2(B) U26.L8(ZQ)
NetR140_2: R140.2(B) U19.L8(ZQ)

Not connected (* = marked no-connect by the designer): U19 J1(NC1) J9(NC4) L1(NC2) L9(NC5); U26 J1(NC1) J9(NC4) L1(NC2) L9(NC5)

### Notes on the sheet
- DDR SDRAM
- (near R243) 1%
- (near R236) 1%
- (near R183) 1%
- (near R187) 1%
- (near R139) 1%
- (near R140) 1%
- (near R184) 1%
- (near R239) 1%
- (near R164) 1%
- (near R108) 1%
- (in symbol GOSPELL) Title:; Rev:; Copyright:; Circuit:; Engineer:; Size:; Date:; Modify Date:; Sheet#:; out of:

### Library data of the parts
C7-C9 C25 C59 C158 C160-C162 C165 C167 C169 C171 = C_0_Dup2: as C48 on sheet P09 SYS of Hi3519; PKG_TYPE: SC0402
C24 C34 C157 C159 C163 C164 C166 C168 = C_0_Dup2: PARTS: 1; OriginalSymbolOrigin: (0,30); DEVICE: CV05X5R105K10AH; LEVEL: STD; PINSWAP: (A,B); GVALUE: C  10V  1uF +80%~-20%  X5R 0402; %208%%161%%192%%224%%195%%251%%179%%198%: SMD陶瓷电容; COMPONENT_HIGH_MAX: 0.55MM; %182%%238%%182%%168%%185%%164%%215%%247%%181%%231%%209%%185%(V): 10; %195%%232%%202%%246%: SMD陶瓷电容-10V-1000NF-+/-10%-X5R-0402-BT,TS16949; CODE: 8070612; PKG_TYPE: SC0402
C58 C229 = C_0_Dup2: PARTS: 1; OriginalSymbolOrigin: (0,30); DEVICE: C1608X5R0J106MT0A0E; LEVEL: STD; PINSWAP: (A,B); CODE: 8070649; %195%%232%%202%%246%: SMD陶瓷电容-6.3V-10000NF-+/-20%-X5R-0603-BT,TS16949; %182%%238%%182%%168%%185%%164%%215%%247%%181%%231%%209%%185%(V): 6.3; COMPONENT_HIGH_MAX: 0.9MM; %208%%161%%192%%224%%195%%251%%179%%198%: SMD陶瓷电容; GVALUE: C  6.3V  10uF +80%~-20%  X5R 0603; PKG_TYPE: SC0603
C74 = C_0_Dup2: PARTS: 1; OriginalSymbolOrigin: (0,30); DEVICE: 04025C102KAT2A; LEVEL: STD; PINSWAP: (A,B); GVALUE: C  50V  1000pF +80%~-20%  X7R 0402; %208%%161%%192%%224%%195%%251%%179%%198%: SMD陶瓷电容; COMPONENT_HIGH_MAX: 0.56MM; %182%%238%%182%%168%%185%%164%%215%%247%%181%%231%%209%%185%(V): 50; %195%%232%%202%%246%: SMD陶瓷电容-50V-1NF-+/-10%-X7R-0402-BT; CODE: 8070531; PKG_TYPE: SC0402
C137 = C_0_Dup2: PARTS: 1; OriginalSymbolOrigin: (0,30); DEVICE: 04025C102KAT2A; LEVEL: STD; PINSWAP: (A,B); %208%%161%%192%%224%%195%%251%%179%%198%: SMD陶瓷电容; COMPONENT_HIGH_MAX: 0.56MM; %182%%238%%182%%168%%185%%164%%215%%247%%181%%231%%209%%185%(V): 50; %195%%232%%202%%246%: SMD陶瓷电容-50V-1NF-+/-10%-X7R-0402-BT; CODE: 8070531; GVALUE: C  50V  1000pF +80%~-20%  X7R 0402; PKG_TYPE: SC0402
C174 = C_0_Dup2: PARTS: 1; OriginalSymbolOrigin: (0,30); DEVICE: CV05X5R105K10AH; LEVEL: STD; PINSWAP: (A,B); %208%%161%%192%%224%%195%%251%%179%%198%: SMD陶瓷电容; COMPONENT_HIGH_MAX: 0.55MM; %182%%238%%182%%168%%185%%164%%215%%247%%181%%231%%209%%185%(V): 10; %195%%232%%202%%246%: SMD陶瓷电容-10V-1000NF-+/-10%-X5R-0402-BT,TS16949; CODE: 8070612; GVALUE: C  10V  1uF +80%~-20%  X5R 0402; PKG_TYPE: SC0402
R7 = R_0: PARTS: 1; OriginalSymbolOrigin: (10,20); PINSWAP: (A,B); DEVICE: RC0402JR_07100R; LEVEL: STD; %208%%161%%192%%224%%195%%251%%179%%198%: 片式厚膜电阻器; COMPONENT_HIGH_MAX: 0.4MM; %215%%232%%214%%181%%212%%202%%208%%237%%198%%171%%178%%238%: +/-5%; %182%%238%%182%%168%%185%%166%%194%%202%(W): 0.06; %195%%232%%202%%246%: 片式厚膜电阻器-0.0625W-100OHM-+/-5%-0402-BT; CODE: 7090807; GVALUE: R 1/16W 100±5% 0402; PKG_TYPE: SR0402
R108 R164 R183 R187 = R_0: PARTS: 1; OriginalSymbolOrigin: (10,20); PINSWAP: (A,B); DEVICE: RC0402FR_071KL; LEVEL: STD; CODE: 7091282; %195%%232%%202%%246%: 片式厚膜电阻器-0.0625W-1000OHM-+/-1%-0402-BT; %182%%238%%182%%168%%185%%166%%194%%202%(W): 0.06; %215%%232%%214%%181%%212%%202%%208%%237%%198%%171%%178%%238%: +/-1%; COMPONENT_HIGH_MAX: 0.4MM; %208%%161%%192%%224%%195%%251%%179%%198%: 片式厚膜电阻器; GVALUE: R 1/16W 1K±5% 0402; PKG_TYPE: SR0402
R139 R140 = R_0: PARTS: 1; OriginalSymbolOrigin: (10,20); PINSWAP: (A,B); DEVICE: RC0402FR_07240RL; LEVEL: STD; %208%%161%%192%%224%%195%%251%%179%%198%: 片式厚膜电阻器; COMPONENT_HIGH_MAX: 0.4MM; %215%%232%%214%%181%%212%%202%%208%%237%%198%%171%%178%%238%: +/- 1%; %182%%238%%182%%168%%185%%166%%194%%202%(W): 0.06; %195%%232%%202%%246%: 片式厚膜电阻器-0.0625W-240OHM-+/- 1%-0402-BT; CODE: 7091782; GVALUE: R 1/16W 240±1% 0402; PKG_TYPE: SR0402
R184 R236 R239 R243 = R_0: PARTS: 1; OriginalSymbolOrigin: (10,20); PINSWAP: (A,B); DEVICE: RC0402FR_071KL; LEVEL: STD; %208%%161%%192%%224%%195%%251%%179%%198%: 片式厚膜电阻器; COMPONENT_HIGH_MAX: 0.4MM; %215%%232%%214%%181%%212%%202%%208%%237%%198%%171%%178%%238%: +/-1%; %182%%238%%182%%168%%185%%166%%194%%202%(W): 0.06; %195%%232%%202%%246%: 片式厚膜电阻器-0.0625W-1000OHM-+/-1%-0402-BT; CODE: 7091282; GVALUE: R 1/16W 1K±5% 0402; PKG_TYPE: SR0402
U19 U26 = NT5CC256M16CP_2: PARTS: 1; OriginalSymbolOrigin: (10,580); LEVEL: STD; CODE: 19V101DDR85; %195%%232%%202%%246%: DDR3 DRAM-4GBIT-933MHZ-16BIT-1.5V-FBGA96(无铅); COMPONENT_HIGH_MAX: 1.2MM; %208%%161%%192%%224%%195%%251%%179%%198%: DDR3 DRAM; GVALUE: NT5CB256M16CP-EK; FORWARD_PCB: 1; PKG_TYPE: BGA96-32-1609G
*#7 = GOSPELL: Cage Code: 2017

## Sheet P07 DDRC of Hi3519.SchDoc
size 420 x 297 mm
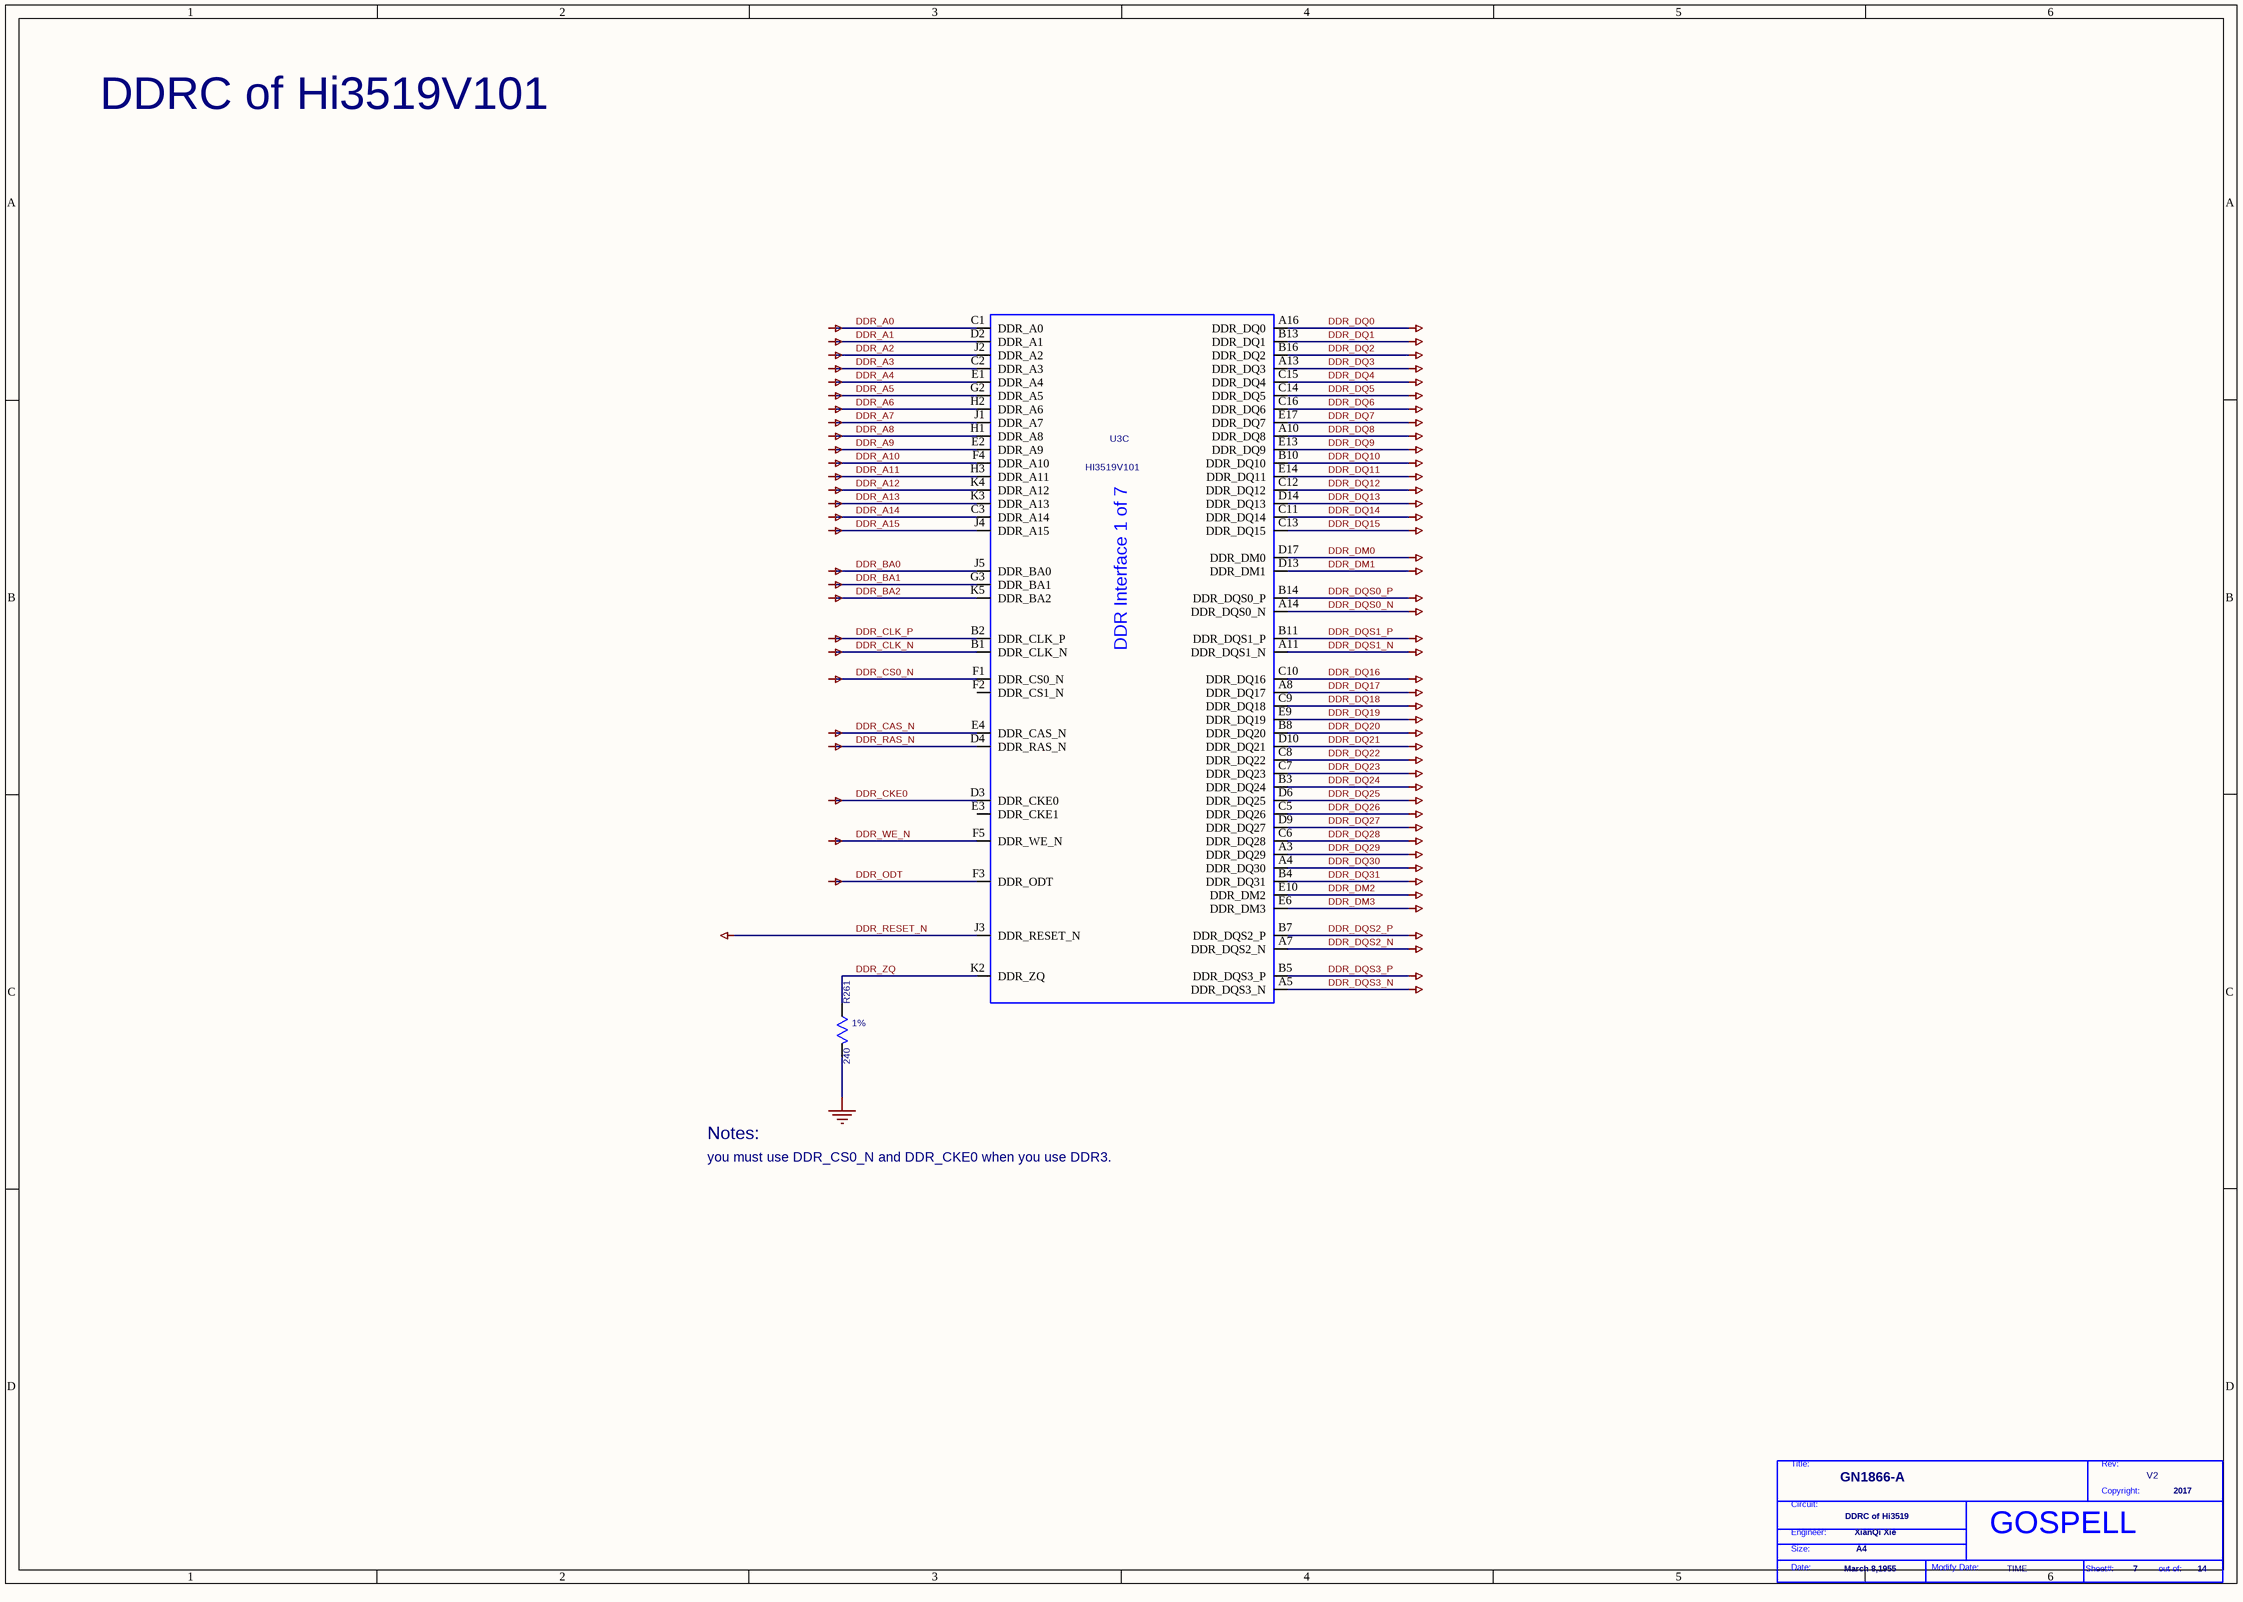
[diagram p7: P07 DDRC of Hi3519.SchDoc]

### Parts
(Parts that share a designator on the sheet are numbered #1, #2 ... from top to bottom, then left to right.)
*#8  Page Modify Date: TIME  Engineer: XianQi Xie  Copyright: 2017  Title: GN1866-A  RevCode: V2  Page Size: A4  Page Create Date: March 8,1955  Page Number: 7  Page Count: 14  Doc: DDRC of Hi3519  (hidden comment: GOSPELL)  (graphical)
R261  240  [SR0402]
U3  DEVICE: HI3519V101  [HBGA524-16-2424]  (hidden comment: HI3519V101_PER)  (part C of 7)

### Nets
DDR_A0: U3.C1(DDR_A0)
DDR_A1: U3.D2(DDR_A1)
DDR_A2: U3.J2(DDR_A2)
DDR_A3: U3.C2(DDR_A3)
DDR_A4: U3.E1(DDR_A4)
DDR_A5: U3.G2(DDR_A5)
DDR_A6: U3.H2(DDR_A6)
DDR_A7: U3.J1(DDR_A7)
DDR_A8: U3.H1(DDR_A8)
DDR_A9: U3.E2(DDR_A9)
DDR_A10: U3.F4(DDR_A10)
DDR_A11: U3.H3(DDR_A11)
DDR_A12: U3.K4(DDR_A12)
DDR_A13: U3.K3(DDR_A13)
DDR_A14: U3.C3(DDR_A14)
DDR_A15: U3.J4(DDR_A15)
DDR_BA0: U3.J5(DDR_BA0)
DDR_BA1: U3.G3(DDR_BA1)
DDR_BA2: U3.K5(DDR_BA2)
DDR_CAS_N: U3.E4(DDR_CAS_N)
DDR_CKE0: U3.D3(DDR_CKE0)
DDR_CLK_N: U3.B1(DDR_CLK_N)
DDR_CLK_P: U3.B2(DDR_CLK_P)
DDR_CS0_N: U3.F1(DDR_CS0_N)
DDR_DM0: U3.D17(DDR_DM0)
DDR_DM1: U3.D13(DDR_DM1)
DDR_DM2: U3.E10(DDR_DM2)
DDR_DM3: U3.E6(DDR_DM3)
DDR_DQ0: U3.A16(DDR_DQ0)
DDR_DQ1: U3.B13(DDR_DQ1)
DDR_DQ2: U3.B16(DDR_DQ2)
DDR_DQ3: U3.A13(DDR_DQ3)
DDR_DQ4: U3.C15(DDR_DQ4)
DDR_DQ5: U3.C14(DDR_DQ5)
DDR_DQ6: U3.C16(DDR_DQ6)
DDR_DQ7: U3.E17(DDR_DQ7)
DDR_DQ8: U3.A10(DDR_DQ8)
DDR_DQ9: U3.E13(DDR_DQ9)
DDR_DQ10: U3.B10(DDR_DQ10)
DDR_DQ11: U3.E14(DDR_DQ11)
DDR_DQ12: U3.C12(DDR_DQ12)
DDR_DQ13: U3.D14(DDR_DQ13)
DDR_DQ14: U3.C11(DDR_DQ14)
DDR_DQ15: U3.C13(DDR_DQ15)
DDR_DQ16: U3.C10(DDR_DQ16)
DDR_DQ17: U3.A8(DDR_DQ17)
DDR_DQ18: U3.C9(DDR_DQ18)
DDR_DQ19: U3.E9(DDR_DQ19)
DDR_DQ20: U3.B8(DDR_DQ20)
DDR_DQ21: U3.D10(DDR_DQ21)
DDR_DQ22: U3.C8(DDR_DQ22)
DDR_DQ23: U3.C7(DDR_DQ23)
DDR_DQ24: U3.B3(DDR_DQ24)
DDR_DQ25: U3.D6(DDR_DQ25)
DDR_DQ26: U3.C5(DDR_DQ26)
DDR_DQ27: U3.D9(DDR_DQ27)
DDR_DQ28: U3.C6(DDR_DQ28)
DDR_DQ29: U3.A3(DDR_DQ29)
DDR_DQ30: U3.A4(DDR_DQ30)
DDR_DQ31: U3.B4(DDR_DQ31)
DDR_DQS0_N: U3.A14(DDR_DQS0_N)
DDR_DQS0_P: U3.B14(DDR_DQS0_P)
DDR_DQS1_N: U3.A11(DDR_DQS1_N)
DDR_DQS1_P: U3.B11(DDR_DQS1_P)
DDR_DQS2_N: U3.A7(DDR_DQS2_N)
DDR_DQS2_P: U3.B7(DDR_DQS2_P)
DDR_DQS3_N: U3.A5(DDR_DQS3_N)
DDR_DQS3_P: U3.B5(DDR_DQS3_P)
DDR_ODT: U3.F3(DDR_ODT)
DDR_RAS_N: U3.D4(DDR_RAS_N)
DDR_RESET_N: U3.J3(DDR_RESET_N)
DDR_WE_N: U3.F5(DDR_WE_N)
GND: R261.2(B)
DDR_ZQ: R261.1(A) U3.K2(DDR_ZQ)

Not connected (* = marked no-connect by the designer): U3 E3(DDR_CKE1) F2(DDR_CS1_N)

### Notes on the sheet
- DDRC of Hi3519V101
- (near R261) 1%
- you must use DDR_CS0_N and DDR_CKE0 when you use DDR3.
- Notes:
- (in symbol GOSPELL) Title:; Rev:; Copyright:; Circuit:; Engineer:; Size:; Date:; Modify Date:; Sheet#:; out of:
- (in symbol HI3519V101_PER_2, part C) DDR Interface 1 of 7

### Library data of the parts
R261 = R_0: as R139 on sheet P08 DDR3; PKG_TYPE: SR0402
U3 = HI3519V101_PER_2: PARTS: 1; OriginalSymbolOrigin: (0,840); LEVEL: STD; HETERO: (HI3519V101_PWR),(HI3519V101_DDR),(HI3519V101_SYS),(HI3519V101_VIVO),(HI3519V101_PER),(HI3519V101_VSS1),(HI3519V101_VSS2); CaptureCellPackProp: HI3519V101_PERC; COMPONENT_HIGH_MAX: 0.98MM; %195%%232%%202%%246%: 请注意是HDI板，建库的时候请注意下-02323838; CODE: G01428016_MODZH; FORWARD_PCB: 1; PKG_TYPE: HBGA524-16-2424; GVALUE: HI3519V101_PER
*#8 = GOSPELL: Cage Code: 2017

## Sheet P06 Power&GND of Hi3519.SchDoc
size 420 x 297 mm
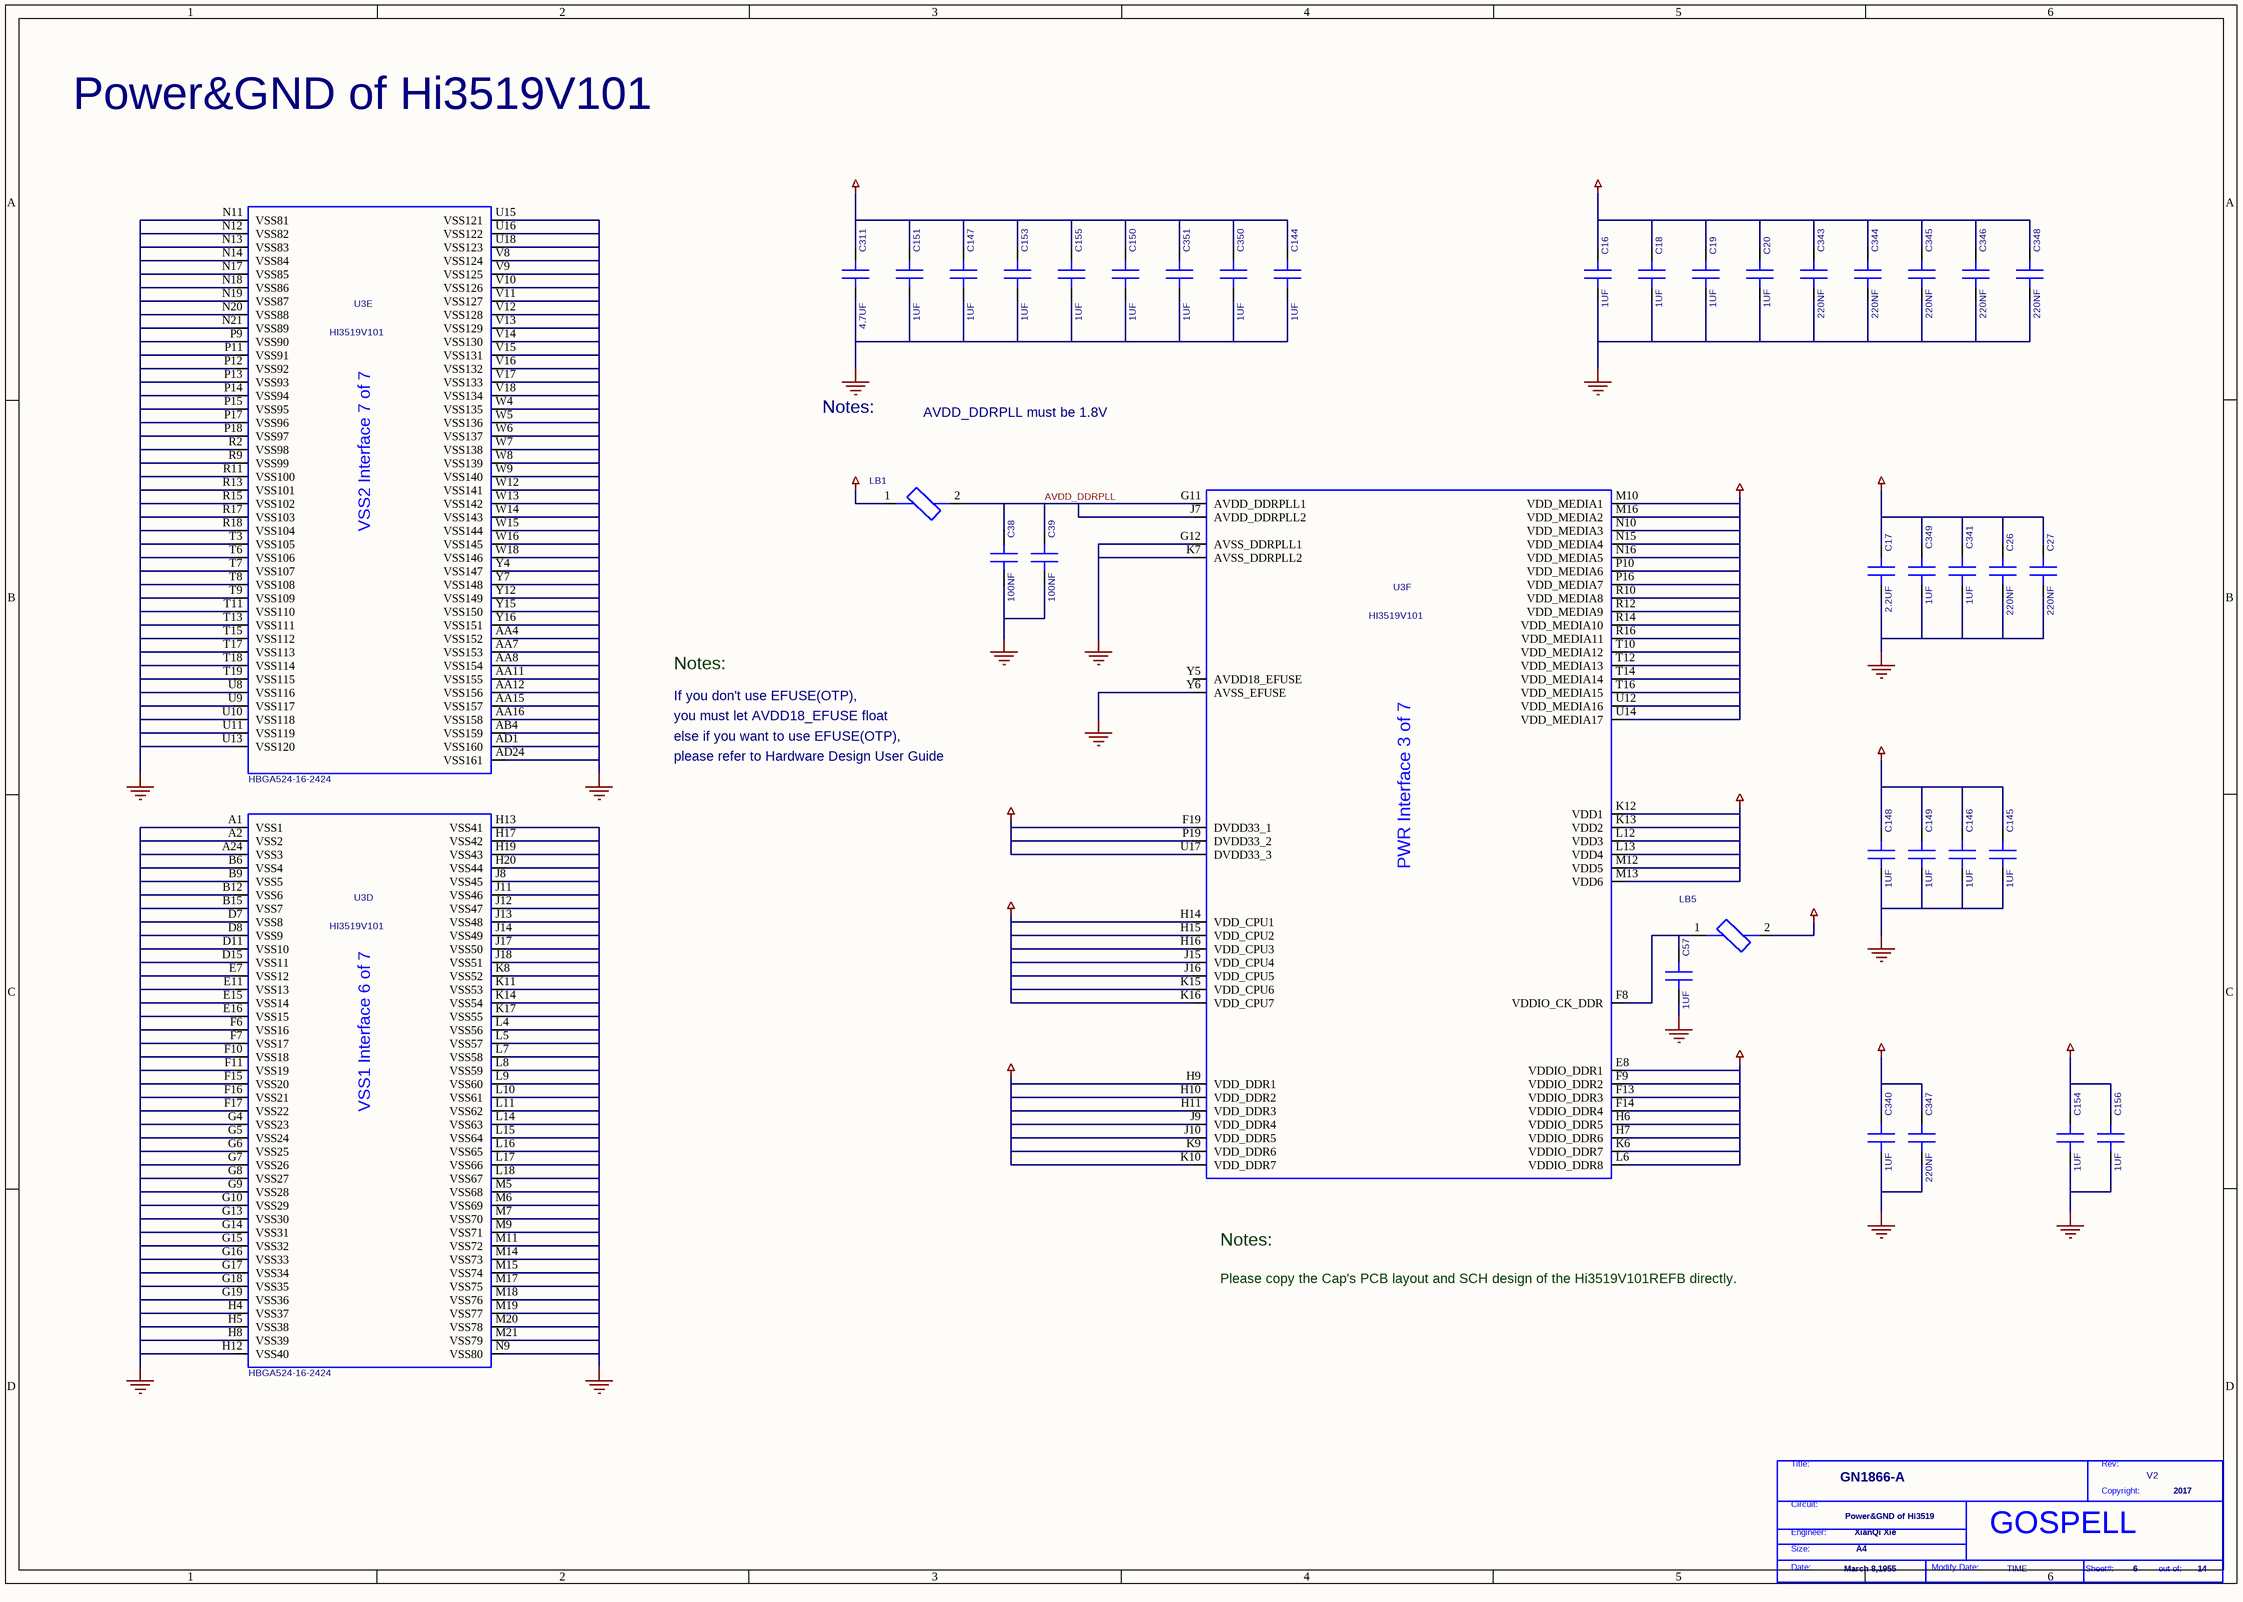
[diagram p8: P06 Power&GND of Hi3519.SchDoc]

### Parts
(Parts that share a designator on the sheet are numbered #1, #2 ... from top to bottom, then left to right.)
*#9  Page Modify Date: TIME  Engineer: XianQi Xie  Copyright: 2017  Title: GN1866-A  RevCode: V2  Page Size: A4  Page Create Date: March 8,1955  Page Number: 6  Page Count: 14  Doc: Power&GND of Hi3519  (hidden comment: GOSPELL)  (graphical)
C16  1UF  [HSC0201]
C17  2.2UF  [SC0402]
C18  1UF  [HSC0201]
C19  1UF  [HSC0201]
C20  1UF  [HSC0201]
C26  220NF  [HSC0201]
C27  220NF  [HSC0201]
C38  100NF  [HSC0201]
C39  100NF  [HSC0201]
C57  1UF  [HSC0201]
C144  1UF  [HSC0201]
C145  1UF  [HSC0201]
C146  1UF  [HSC0201]
C147  1UF  [HSC0201]
C148  1UF  [HSC0201]
C149  1UF  [HSC0201]
C150  1UF  [HSC0201]
C151  1UF  [HSC0201]
C153  1UF  [HSC0201]
C154  1UF  [HSC0201]
C155  1UF  [HSC0201]
C156  1UF  [HSC0201]
C311  4.7UF  [SC0402]
C340  1UF  [HSC0201]
C341  1UF  [HSC0201]
C343  220NF  [HSC0201]
C344  220NF  [HSC0201]
C345  220NF  [HSC0201]
C346  220NF  [HSC0201]
C347  220NF  [HSC0201]
C348  220NF  [HSC0201]
C349  1UF  [HSC0201]
C350  1UF  [HSC0201]
C351  1UF  [HSC0201]
LB1  LB  [HSL0201-TB]  (value not drawn)
LB5  LB  [HSL0201-TB]  (value not drawn)
U3  DEVICE: HI3519V101  [HBGA524-16-2424]  (hidden comment: HI3519V101_PER)  (parts D,E,F of 7)

### Nets
1V8: LB1.1
1V35/1V5: C144.1(A) C147.1(A) C150.1(A) C151.1(A) C153.1(A) C155.1(A) C311.1(A) C350.1(A) C351.1(A) LB5.2 U3.E8(VDDIO_DDR1) U3.F9(VDDIO_DDR2) U3.F13(VDDIO_DDR3) U3.F14(VDDIO_DDR4) U3.H6(VDDIO_DDR5) U3.H7(VDDIO_DDR6) U3.K6(VDDIO_DDR7) U3.L6(VDDIO_DDR8)
3V3: C145.1(A) C146.1(A) C148.1(A) C149.1(A) U3.F19(DVDD33_1) U3.P19(DVDD33_2) U3.U17(DVDD33_3)
GND: C16.2(B) C17.2(B) C18.2(B) C19.2(B) C20.2(B) C26.2(B) C27.2(B) C38.2(B) C39.2(B) C57.2(B) C144.2(B) C145.2(B) C146.2(B) C147.2(B) C148.2(B) C149.2(B) C150.2(B) C151.2(B) C153.2(B) C154.2(B) C155.2(B) C156.2(B) C311.2(B) C340.2(B) C341.2(B) C343.2(B) C344.2(B) C345.2(B) C346.2(B) C347.2(B) C348.2(B) C349.2(B) C350.2(B) C351.2(B) U3.A1(VSS1) U3.A2(VSS2) U3.A24(VSS3) U3.AA4(VSS152) U3.AA7(VSS153) U3.AA8(VSS154) U3.AA11(VSS155) U3.AA12(VSS156) U3.AA15(VSS157) U3.AA16(VSS158) U3.AB4(VSS159) U3.AD1(VSS160) U3.AD24(VSS161) U3.B6(VSS4) U3.B9(VSS5) U3.B12(VSS6) U3.B15(VSS7) U3.D7(VSS8) U3.D8(VSS9) U3.D11(VSS10) U3.D15(VSS11) U3.E7(VSS12) U3.E11(VSS13) U3.E15(VSS14) U3.E16(VSS15) U3.F6(VSS16) U3.F7(VSS17) U3.F10(VSS18) U3.F11(VSS19) U3.F15(VSS20) U3.F16(VSS21) U3.F17(VSS22) U3.G4(VSS23) U3.G5(VSS24) U3.G6(VSS25) U3.G7(VSS26) U3.G8(VSS27) U3.G9(VSS28) U3.G10(VSS29) U3.G12(AVSS_DDRPLL1) U3.G13(VSS30) U3.G14(VSS31) U3.G15(VSS32) U3.G16(VSS33) U3.G17(VSS34) U3.G18(VSS35) U3.G19(VSS36) U3.H4(VSS37) U3.H5(VSS38) U3.H8(VSS39) U3.H12(VSS40) U3.H13(VSS41) U3.H17(VSS42) U3.H19(VSS43) U3.H20(VSS44) U3.J8(VSS45) U3.J11(VSS46) U3.J12(VSS47) U3.J13(VSS48) U3.J14(VSS49) U3.J17(VSS50) U3.J18(VSS51) U3.K7(AVSS_DDRPLL2) U3.K8(VSS52) U3.K11(VSS53) U3.K14(VSS54) U3.K17(VSS55) U3.L4(VSS56) U3.L5(VSS57) U3.L7(VSS58) U3.L8(VSS59) U3.L9(VSS60) U3.L10(VSS61) U3.L11(VSS62) U3.L14(VSS63) U3.L15(VSS64) U3.L16(VSS65) U3.L17(VSS66) U3.L18(VSS67) U3.M5(VSS68) U3.M6(VSS69) U3.M7(VSS70) U3.M9(VSS71) U3.M11(VSS72) U3.M14(VSS73) U3.M15(VSS74) U3.M17(VSS75) U3.M18(VSS76) U3.M19(VSS77) U3.M20(VSS78) U3.M21(VSS79) U3.N9(VSS80) U3.N11(VSS81) U3.N12(VSS82) U3.N13(VSS83) U3.N14(VSS84) U3.N17(VSS85) U3.N18(VSS86) U3.N19(VSS87) U3.N20(VSS88) U3.N21(VSS89) U3.P9(VSS90) U3.P11(VSS91) U3.P12(VSS92) U3.P13(VSS93) U3.P14(VSS94) U3.P15(VSS95) U3.P17(VSS96) U3.P18(VSS97) U3.R2(VSS98) U3.R9(VSS99) U3.R11(VSS100) U3.R13(VSS101) U3.R15(VSS102) U3.R17(VSS103) U3.R18(VSS104) U3.T3(VSS105) U3.T6(VSS106) U3.T7(VSS107) U3.T8(VSS108) U3.T9(VSS109) U3.T11(VSS110) U3.T13(VSS111) U3.T15(VSS112) U3.T17(VSS113) U3.T18(VSS114) U3.T19(VSS115) U3.U8(VSS116) U3.U9(VSS117) U3.U10(VSS118) U3.U11(VSS119) U3.U13(VSS120) U3.U15(VSS121) U3.U16(VSS122) U3.U18(VSS123) U3.V8(VSS124) U3.V9(VSS125) U3.V10(VSS126) U3.V11(VSS127) U3.V12(VSS128) U3.V13(VSS129) U3.V14(VSS130) U3.V15(VSS131) U3.V16(VSS132) U3.V17(VSS133) U3.V18(VSS134) U3.W4(VSS135) U3.W5(VSS136) U3.W6(VSS137) U3.W7(VSS138) U3.W8(VSS139) U3.W9(VSS140) U3.W12(VSS141) U3.W13(VSS142) U3.W14(VSS143) U3.W15(VSS144) U3.W16(VSS145) U3.W18(VSS146) U3.Y4(VSS147) U3.Y6(AVSS_EFUSE) U3.Y7(VSS148) U3.Y12(VSS149) U3.Y15(VSS150) U3.Y16(VSS151)
VCC_CPU_CORE: C17.1(A) C26.1(A) C27.1(A) C341.1(A) C349.1(A) U3.H14(VDD_CPU1) U3.H15(VDD_CPU2) U3.H16(VDD_CPU3) U3.J15(VDD_CPU4) U3.J16(VDD_CPU5) U3.K15(VDD_CPU6) U3.K16(VDD_CPU7)
VCC_MEDIA_CORE: C16.1(A) C18.1(A) C19.1(A) C20.1(A) C343.1(A) C344.1(A) C345.1(A) C346.1(A) C348.1(A) U3.M10(VDD_MEDIA1) U3.M16(VDD_MEDIA2) U3.N10(VDD_MEDIA3) U3.N15(VDD_MEDIA4) U3.N16(VDD_MEDIA5) U3.P10(VDD_MEDIA6) U3.P16(VDD_MEDIA7) U3.R10(VDD_MEDIA8) U3.R12(VDD_MEDIA9) U3.R14(VDD_MEDIA10) U3.R16(VDD_MEDIA11) U3.T10(VDD_MEDIA12) U3.T12(VDD_MEDIA13) U3.T14(VDD_MEDIA14) U3.T16(VDD_MEDIA15) U3.U12(VDD_MEDIA16) U3.U14(VDD_MEDIA17)
VCC_VDD_DDR_CORE: C154.1(A) C156.1(A) C340.1(A) C347.1(A) U3.H9(VDD_DDR1) U3.H10(VDD_DDR2) U3.H11(VDD_DDR3) U3.J9(VDD_DDR4) U3.J10(VDD_DDR5) U3.K9(VDD_DDR6) U3.K10(VDD_DDR7) U3.K12(VDD1) U3.K13(VDD2) U3.L12(VDD3) U3.L13(VDD4) U3.M12(VDD5) U3.M13(VDD6)
AVDD_DDRPLL: C38.1(A) C39.1(A) LB1.2 U3.G11(AVDD_DDRPLL1) U3.J7(AVDD_DDRPLL2)
NetC57_1: C57.1(A) LB5.1 U3.F8(VDDIO_CK_DDR)

Not connected (* = marked no-connect by the designer): U3 Y5(AVDD18_EFUSE)

### Notes on the sheet
- Power&GND of Hi3519V101
- Notes:
- AVDD_DDRPLL must be 1.8V
- you must let AVDD18_EFUSE float
- If you don't use EFUSE(OTP),
- please refer to Hardware Design User Guide
- else if you want to use EFUSE(OTP),
- Please copy the Cap's PCB layout and SCH design of the Hi3519V101REFB directly.
- (in symbol GOSPELL) Title:; Rev:; Copyright:; Circuit:; Engineer:; Size:; Date:; Modify Date:; Sheet#:; out of:
- (in symbol HI3519V101_PER_2, part D) VSS1 Interface 6 of 7
- (in symbol HI3519V101_PER_2, part E) VSS2 Interface 7 of 7
- (in symbol HI3519V101_PER_2, part F) PWR Interface 3 of 7

### Library data of the parts
C16 C18 C20 C340 = C_0_Dup2: as C183 on sheet P09 SYS of Hi3519; PKG_TYPE: HSC0201
C17 = C_0_Dup2: PARTS: 1; OriginalSymbolOrigin: (0,30); DEVICE: GRM155R60J225ME15D; LEVEL: STD; PINSWAP: (A,B); %208%%161%%192%%224%%195%%251%%179%%198%: SMD陶瓷电容; COMPONENT_HIGH_MAX: 0.6MM; %182%%238%%182%%168%%185%%164%%215%%247%%181%%231%%209%%185%(V): 6.3; %195%%232%%202%%246%: SMD陶瓷电容-6.3V-2200NF-+/-20%-X5R-0402-TS16949; CODE: 8070667; GVALUE: C  6.3V  2.2uF +80%~-20%  X5R 0402; PKG_TYPE: SC0402
C19 = C_0_Dup2: PARTS: 1; OriginalSymbolOrigin: (0,30); DEVICE: CM03X5R105M06AH_A; LEVEL: STD; PINSWAP: (A,B); GVALUE: C  4V  1uF +80%~-20%  X5R 0201(0.65MM*0.35MM*0.35MM); %208%%161%%192%%224%%195%%251%%179%%198%: SMD陶瓷电容; COMPONENT_HIGH_MAX: 0.35MM; %182%%238%%182%%168%%185%%164%%215%%247%%181%%231%%209%%185%(V): 6.3; %195%%232%%202%%246%: SMD陶瓷电容-4V-1000NF-+/-20%-X5R-0201(0.65MM*0.35MM*0.35MM)-终端专用; CODE: 8071128; PKG_TYPE: HSC0201
C26 C344 C346 = C_0_Dup2: PARTS: 1; OriginalSymbolOrigin: (0,30); DEVICE: GRM033R60J104KE19D; LEVEL: STD; PINSWAP: (A,B); CODE: 8070752; %195%%232%%202%%246%: SMD陶瓷电容-6.3V-220NF-+/-20%-X5R-0201-终端专用-终端专用; %182%%238%%182%%168%%185%%164%%215%%247%%181%%231%%209%%185%(V): 6.3; COMPONENT_HIGH_MAX: 0.33MM; %208%%161%%192%%224%%195%%251%%179%%198%: SMD陶瓷电容; GVALUE: C  6.3V  0.22uF +80%~-20%  X5R 0201; PKG_TYPE: HSC0201
C27 C343 C345 C347 C348 = C_0_Dup2: PARTS: 1; OriginalSymbolOrigin: (0,30); DEVICE: GRM033R60J104KE19D; LEVEL: STD; PINSWAP: (A,B); %208%%161%%192%%224%%195%%251%%179%%198%: SMD陶瓷电容; COMPONENT_HIGH_MAX: 0.33MM; %182%%238%%182%%168%%185%%164%%215%%247%%181%%231%%209%%185%(V): 6.3; %195%%232%%202%%246%: SMD陶瓷电容-6.3V-220NF-+/-20%-X5R-0201-终端专用-终端专用; CODE: 8070752; GVALUE: C  6.3V  0.22uF +80%~-20%  X5R 0201; PKG_TYPE: HSC0201
C38 = C_0_Dup2: as C29 on sheet P09 SYS of Hi3519; PKG_TYPE: HSC0201
C39 = C_0_Dup2: PARTS: 1; OriginalSymbolOrigin: (0,30); DEVICE: GRM033R60J104KE19D; LEVEL: STD; PINSWAP: (A,B); %208%%161%%192%%224%%195%%251%%179%%198%: SMD陶瓷电容; COMPONENT_HIGH_MAX: 0.33MM; %182%%238%%182%%168%%185%%164%%215%%247%%181%%231%%209%%185%(V): 6.3; %195%%232%%202%%246%: SMD陶瓷电容-6.3V-100NF-+/-10%-X5R-0201-TS16949; CODE: 8070704; GVALUE: C  6.3V  0.1uF +80%~-20%  X5R 0201; PKG_TYPE: HSC0201
C57 C144 C148 C151 C153 C155 C350 C351 = C_0_Dup2: PARTS: 1; OriginalSymbolOrigin: (0,30); DEVICE: CM03X5R105M06AH_A; LEVEL: STD; PINSWAP: (A,B); CODE: 8071128; %195%%232%%202%%246%: SMD陶瓷电容-4V-1000NF-+/-20%-X5R-0201(0.65MM*0.35MM*0.35MM)-终端专用; %182%%238%%182%%168%%185%%164%%215%%247%%181%%231%%209%%185%(V): 10; COMPONENT_HIGH_MAX: 0.35MM; %208%%161%%192%%224%%195%%251%%179%%198%: SMD陶瓷电容; GVALUE: C  4V  1uF +80%~-20%  X5R 0201(0.65MM*0.35MM*0.35MM); PKG_TYPE: HSC0201
C145 C147 C149 C150 C156 C341 C349 = C_0_Dup2: as C306 on sheet P09 SYS of Hi3519; PKG_TYPE: HSC0201
C146 C154 = C_0_Dup2: PARTS: 1; OriginalSymbolOrigin: (0,30); DEVICE: CM03X5R105M06AH_A; LEVEL: STD; PINSWAP: (A,B); GVALUE: C  4V  1uF +80%~-20%  X5R 0201(0.65MM*0.35MM*0.35MM); %208%%161%%192%%224%%195%%251%%179%%198%: SMD陶瓷电容; COMPONENT_HIGH_MAX: 0.35MM; %182%%238%%182%%168%%185%%164%%215%%247%%181%%231%%209%%185%(V): 10; %195%%232%%202%%246%: SMD陶瓷电容-4V-1000NF-+/-20%-X5R-0201(0.65MM*0.35MM*0.35MM)-终端专用; CODE: 8071128; PKG_TYPE: HSC0201
C311 = C_0_Dup2: PARTS: 1; OriginalSymbolOrigin: (0,30); DEVICE: C1005X5R0J475MTJ00F; LEVEL: STD; PINSWAP: (A,B); %208%%161%%192%%224%%195%%251%%179%%198%: SMD陶瓷电容; COMPONENT_HIGH_MAX: 0.65MM; %182%%238%%182%%168%%185%%164%%215%%247%%181%%231%%209%%185%(V): 6.3; %195%%232%%202%%246%: SMD陶瓷电容-6.3V-4700NF-+/-20%-X5R-0402; CODE: 8071610; GVALUE: C  6.3V  4.7uF +80%~-20%  X5R 0402; PKG_TYPE: SC0402
LB1 = LB_0: PARTS: 1; OriginalSymbolOrigin: (20,50); LEVEL: STD; DEVICE: NOOO; %195%%232%%202%%246%: EMI磁珠-+/-25%-1000OHM-1.25OHM-0.25A-0402-1400OHM@1GHZ; COMPONENT_HIGH_MAX: 0.65MM; %208%%161%%192%%224%%195%%251%%179%%198%: EMI磁珠; CODE: 99053XWH; GVALUE: 麦捷:0201磁珠80欧; PKG_TYPE: HSL0201-TB
LB5 = LB_0: as LB8 on sheet P09 SYS of Hi3519; PKG_TYPE: HSL0201-TB
U3 = HI3519V101_PER_2: PARTS: 1; OriginalSymbolOrigin: (0,840); LEVEL: STD; HETERO: (HI3519V101_PWR),(HI3519V101_DDR),(HI3519V101_SYS),(HI3519V101_VIVO),(HI3519V101_PER),(HI3519V101_VSS1),(HI3519V101_VSS2); CODE: G01428016_MODZH; %195%%232%%202%%246%: 请注意是HDI板，建库的时候请注意下-02323838; COMPONENT_HIGH_MAX: 0.98MM; CaptureCellPackProp: HI3519V101_PERD; FORWARD_PCB: 1; PKG_TYPE: HBGA524-16-2424; GVALUE: HI3519V101_PER
*#9 = GOSPELL: Cage Code: 2017